# Altium project FLEXI_HAL_Quark.PrjPCB (part 3 of 5)

## Sheet USB_ULPI_Interface.SchDoc: STM32F446 CNC
size B; Author: AM; CompanyName: Expatria Technologies; DrawnBy: A.Marles; Engineer: AM; Organization: Expatria Technolgoies; Address1: PO Box 2084; Address3: Merritt, BC V1K 1B8; Address4: Canada; DocumentNumber: 7; Revision: A1; SheetNumber: 7; SheetTotal: 26
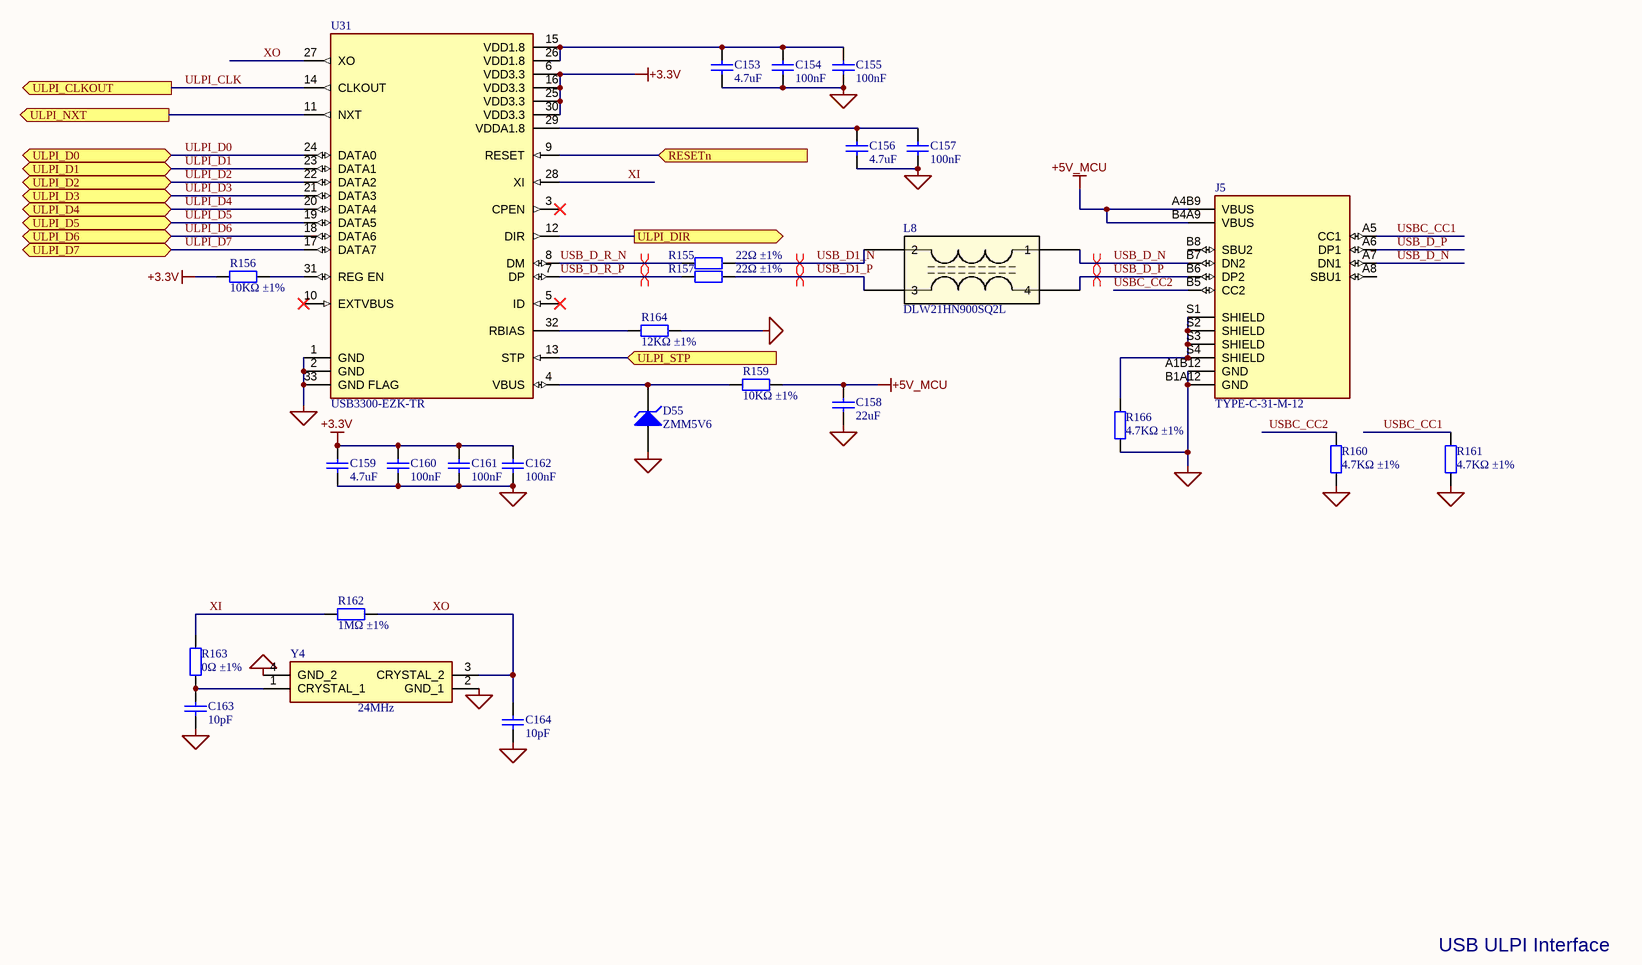
[diagram p10: USB_ULPI_Interface.SchDoc]

### Parts
C153  4.7uF  [0603_C]
C154  100nF  [0603_C]
C155  100nF  [0603_C]
C156  4.7uF  [0603_C]
C157  100nF  [0603_C]
C158  22uF  [0805_C]
C159  4.7uF  [0603_C]
C160  100nF  [0603_C]
C161  100nF  [0603_C]
C162  100nF  [0603_C]
C163  10pF  [0402_C]
C164  10pF  [0402_C]
D55  ZMM5V6  [LL-34]
J5  TYPE-C-31-M-12  [HRO_TYPE-C-31-M-12]
L8  DLW21HN900SQ2L  [DLW21HN121HQ2B]
R155  22Ω ±1%  [0603_R]
R156  10KΩ ±1%  [0603_R]
R157  22Ω ±1%  [0603_R]
R159  10KΩ ±1%  [0603_R]
R160  4.7KΩ ±1%  [0603_R]
R161  4.7KΩ ±1%  [0603_R]
R162  1MΩ ±1%  [0402_R]
R163  0Ω ±1%  [0402_R]
R164  12KΩ ±1%  [0603_R]
R166  4.7KΩ ±1%  [0603_R]
U31  USB3300-EZK-TR  [FP-32QFN-3304-5X5B-MFG]
Y4  value 24MHz  [YSX321SL]  (hidden comment: X322524MSB4SI)

### Ports
RESETn (in), ULPI_CLKOUT (out), ULPI_D0 (bidir), ULPI_D1 (bidir), ULPI_D2 (bidir), ULPI_D3 (bidir), ULPI_D4 (bidir), ULPI_D5 (bidir), ULPI_D6 (bidir), ULPI_D7 (bidir), ULPI_DIR (out), ULPI_NXT (out), ULPI_STP (in)

### Nets
+3.3V: C159.2 C160.2 C161.2 C162.2 R156.1 U31.6(VDD3.3) U31.16(VDD3.3) U31.25(VDD3.3) U31.30(VDD3.3)
+5V_MCU: C158.2 J5.A4B9(VBUS) J5.B4A9(VBUS) R159.2
MCU_GND: C153.1 C154.1 C155.1 C156.1 C157.1 C158.1 C159.1 C160.1 C161.1 C162.1 C163.1 C164.1 D55.1(A) J5.A1B12(GND) J5.B1A12(GND) R160.2 R161.2 R164.2 R166.2 U31.1(GND) U31.2(GND) U31.33(GND_FLAG) Y4.2(GND_1) Y4.4(GND_2)
STM_RESET: U31.9(RESET) ; port RESETn
ULPI_CLK: U31.14(CLKOUT) ; port ULPI_CLKOUT  [project net ULPI_CLKOUT]
ULPI_D0: U31.24(DATA0) ; port ULPI_D0
ULPI_D1: U31.23(DATA1) ; port ULPI_D1
ULPI_D2: U31.22(DATA2) ; port ULPI_D2
ULPI_D3: U31.21(DATA3) ; port ULPI_D3
ULPI_D4: U31.20(DATA4) ; port ULPI_D4
ULPI_D5: U31.19(DATA5) ; port ULPI_D5
ULPI_D6: U31.18(DATA6) ; port ULPI_D6
ULPI_D7: U31.17(DATA7) ; port ULPI_D7
ULPI_DIR: U31.12(DIR) ; port ULPI_DIR
ULPI_NXT: U31.11(NXT) ; port ULPI_NXT
ULPI_STP: U31.13(STP) ; port ULPI_STP
USB_D1_N: L8.2 R155.2
USB_D1_P: L8.3 R157.2
USB_D_N: J5.A7(DN1) J5.B7(DN2) L8.1
USB_D_P: J5.A6(DP1) J5.B6(DP2) L8.4
USB_D_R_N: R155.1 U31.8(DM)
USB_D_R_P: R157.1 U31.7(DP)
USBC_CC1: J5.A5(CC1) R161.1
USBC_CC2: J5.B5(CC2) R160.1
XI: R162.1 R163.1 U31.28(XI)
XO: C164.2 R162.2 U31.27(XO) Y4.3(CRYSTAL_2)
NetC153_2: C153.2 C154.2 C155.2 U31.15(VDD1.8) U31.26(VDD1.8)
NetC156_2: C156.2 C157.2 U31.29(VDDA1.8)
NetC163_2: C163.2 R163.2 Y4.1(CRYSTAL_1)
NetD55_2: D55.2(K) R159.1 U31.4(VBUS)
NetJ5_S1: J5.S1(SHIELD) J5.S2(SHIELD) J5.S3(SHIELD) J5.S4(SHIELD) R166.1
NetR156_2: R156.2 U31.31(REG_EN)
NetR164_1: R164.1 U31.32(RBIAS)

Not connected (* = marked no-connect by the designer): J5 A8(SBU1) B8(SBU2); U31 3(CPEN)* 5(ID)* 10(EXTVBUS)*

### Layout directives
differential pair: USB_D1_N, USB_D1_P, USB_D_N, USB_D_P, USB_D_R_N, USB_D_R_P

### Notes on the sheet
- USB ULPI Interface
- SHEET
- Expatria Technologies
- PO Box 2084
- Merritt, BC V1K 1B8
- PHONE: (778) 238-9336
- PROJECT
- SIZE
- ENGR
- MODIFIED
- DOCUMENT
- REV
- Copyright Expatria Technologies 2022. This document describes Open Hardware and is licensed under the CERN-OHL-S v2. No warranty is implied or expressed.
- EMAIL: info@expatria.ca
- B
- /

### Library data of the parts
C153 C156 C159 = 0603 4.7uF (475) 10% 16V: Chip capacitors; Manufacturer: Samsung Electro-Mechanics; PartNumber: CL10A475KO8NNNC; Tolerance: 10%; Voltage: 16V; ComponentLink1Description: Supplier link; ComponentLink1URL: http://www.szlcsc.com/product/details_20375.html; Package: 0603; Supplier: LC; SuppliersPartNumber: C19666; Capacitance: 4.7uF
C154 C155 C157 C160-C162 = 0603 100nF (104) 10% 50V: Chip capacitors; Manufacturer: YAGEO; PartNumber: CC0603KRX7R9BB104; Tolerance: 10%; Voltage: 50V; ComponentLink1Description: Supplier link; ComponentLink1URL: http://www.szlcsc.com/product/details_15331.html; Package: 0603; Supplier: LC; SuppliersPartNumber: C14663; Capacitance: 100nF
C158 = 0805 22uF (226) 20% 25V: Chip capacitors; Manufacturer: Samsung Electro-Mechanics; PartNumber: CL21A226MAQNNNE; Tolerance: 20%; Voltage: 25V; Package: 0805; Supplier: LC; SuppliersPartNumber: C2922481; Capacitance: 22uF; ComponentLink1Description: Supplier link; ComponentLink1URL: http://www.szlcsc.com/product/details_46786.html
C163 C164 = 0402 10pF (100) 5% 50V: Chip capacitors; Manufacturer: Samsung Electro-Mechanics; Manufacturer Part Number: CL05C100JB5NNNC; Tolerance: 5%; Voltage: 50V; ComponentLink1Description: Supplier link; ComponentLink1URL: http://www.szlcsc.com/product/details_33914.html; Package: 0402; Supplier: LC; SuppliersPartNumber: C32949; Capacitance: 10pF
D55 = LL-34 ZMM5V6: 500mW - 0.1uA @ 1V 5.6V LL-34 Zener Diodes ROHS; ComponentLink1Description: 供应商链接; ComponentLink1URL: http://www.szlcsc.com/product/details_8541.html; Package: LL-34; Supplier: LC; SuppliersPartNumber: C8062
J5 = TYPE-C-31-M-12: USB Connectors 24 Receptacle 1 8.94*7.3mm RoHS; MF: HRO Electronics Co., Ltd.; Value: *; SnapEDA_Link: https://www.snapeda.com/parts/TYPE-C-31-M-12/HRO%20Electronics%20Co.,%20Ltd./view-part/3228496/?ref=snap; Package: Package; MP: TYPE-C-31-M-12; Price: None; Availability: Unavailable; SuppliersPartNumber: C2765186
L8 = DLW21HN900SQ2L: 90Ω@100MHz -40℃~+85℃ 350mΩ 50V 2 330mA 125V SMD-4P Common Mode Filters ROHS; Manufacturer: Murata Electronics; SuppliersPartNumber: C80529; Manufacturer Part Number: DLW21HN900SQ2L; Supplier: LCSC; Value: DLW21HN900SQ2L
R155 R157 = 0603 22R (22R0) 1%: Chip resistor; Manufacturer: Uniroyal Elec; PartNumber: 0603WAF220JT5E; Power: 1/10W; ComponentLink1Description: Supplier link; ComponentLink1URL: http://www.szlcsc.com/product/details_24078.html; Package: 0603; Supplier: LC; SuppliersPartNumber: C23345; Resistance: 22Ω; Tolerance: 1%
R156 R159 = 0603 10K (1002) 1%: Chip resistor; Manufacturer: Uniroyal Elec; PartNumber: 0603WAF1002T5E; Power: 1/10W; ComponentLink1Description: Supplier link; ComponentLink1URL: http://www.szlcsc.com/product/details_26547.html; Package: 0603; Supplier: LC; SuppliersPartNumber: C25804; Resistance: 10KΩ; Tolerance: 1%
R160 R161 R166 = 0603 4.7K (4701) 1%: Chip resistor; Manufacturer: Uniroyal Elec; PartNumber: 0603WAF4701T5E; Power: 1/10W; ComponentLink1Description: Supplier link; ComponentLink1URL: http://www.szlcsc.com/product/details_23889.html; Package: 0603; Supplier: LC; SuppliersPartNumber: C23162; Resistance: 4.7KΩ; Tolerance: 1%
R162 = 0402 1M (1004) 1%: Chip resistor; Manufacturer: Uniroyal Elec; Manufacturer Part Number: 0402WGF1004TCE; Power: 1/16W; ComponentLink1Description: Supplier link; ComponentLink1URL: http://www.szlcsc.com/product/details_26826.html; Package: 0402; Supplier: LC; SuppliersPartNumber: C26083; Resistance: 1MΩ; Tolerance: 1%
R163 = 0402 0R (0R0) 1%: Chip resistor; Manufacturer: Uniroyal Elec; Manufacturer Part Number: 0402WGF0000TCE; Power: 1/16W; ComponentLink1Description: Supplier link; ComponentLink1URL: http://www.szlcsc.com/product/details_17853.html; Package: 0402; Supplier: LC; SuppliersPartNumber: C17168; Resistance: 0Ω; Tolerance: 1%
R164 = 0603 12K (1202) 1%: Chip resistor; Manufacturer: Uniroyal Elec; PartNumber: 0603WAF1202T5E; Power: 1/10W; ComponentLink1Description: Supplier link; ComponentLink1URL: http://www.szlcsc.com/product/details_23517.html; Package: 0603; Supplier: LC; SuppliersPartNumber: C22790; Resistance: 12KΩ; Tolerance: 1%
U31 = CMP-0186-00339-2: IC CONTROLLER USB 32QFN; Manufacturer: Microchip; Min Supply Voltage: 3V; Standoff Height: 0mm; Interface: USB,Other; Number Of Ports: 1; Usb Standard: USB 2.0; Nominal Supply Current: 25.5-39600uA; Max Supply Voltage: 3.6V; Temperature Range High: +85°C; Mouser Description: USB Interface IC USB 2.0 PHY ULPI; Device Class L3: USB Interface ICs; Package: 32QFN-3304-5X5B; ComponentLink2URL: http://ww1.microchip.com/downloads/en/DeviceDoc/00001783C.pdf; Ambient Temperature Range Low: -40°C; Temperature Range Low: -40°C; Temperature: -40°C to +85°C; ComponentLink2Description: Datasheet; RoHS: TRUE; Digikey Description: IC CONTROLLER USB 32QFN; Device Class L1: Integrated Circuits (ICs); Manufacturer Part Number: USB3300-EZK-TR; Automotive: No; Height: 1mm; Ipc Land Pattern Name: QFN50P500X500X85-32; Lead Free: Yes; Ambient Temperature Range High: +85°C; Category: IC; Device Class L2: Interface ICs; Octopart: https://octopart.com/usb3300-ezk-tr-microchip-24995444
Y4 = X322525MSB4SI: 24MHz SMD Crystal Resonator 20pF ±10ppm ±30ppm -40℃~+85℃ SMD3225-4P Crystals ROHS; Manufacturer 1: Yangxing Tech; Height: 0.8mm; SuppliersPartNumber: C15643; Supplier 1: LCSC; Supplier Part Number 1: C15643; Manufacturer Part Number 1: X322524MSB4SI; Manufacturer: Yangxing Tech; Manufacturer Part Number: X322524MSB4SI

## Sheet 5V_Power_Supply.SchDoc: STM32F446 CNC
size B; Author: AM; CompanyName: Expatria Technologies; DrawnBy: A.Marles; Engineer: AM; Organization: Expatria Technolgoies; DocumentNumber: 9; Revision: A1; SheetNumber: 9; SheetTotal: 14
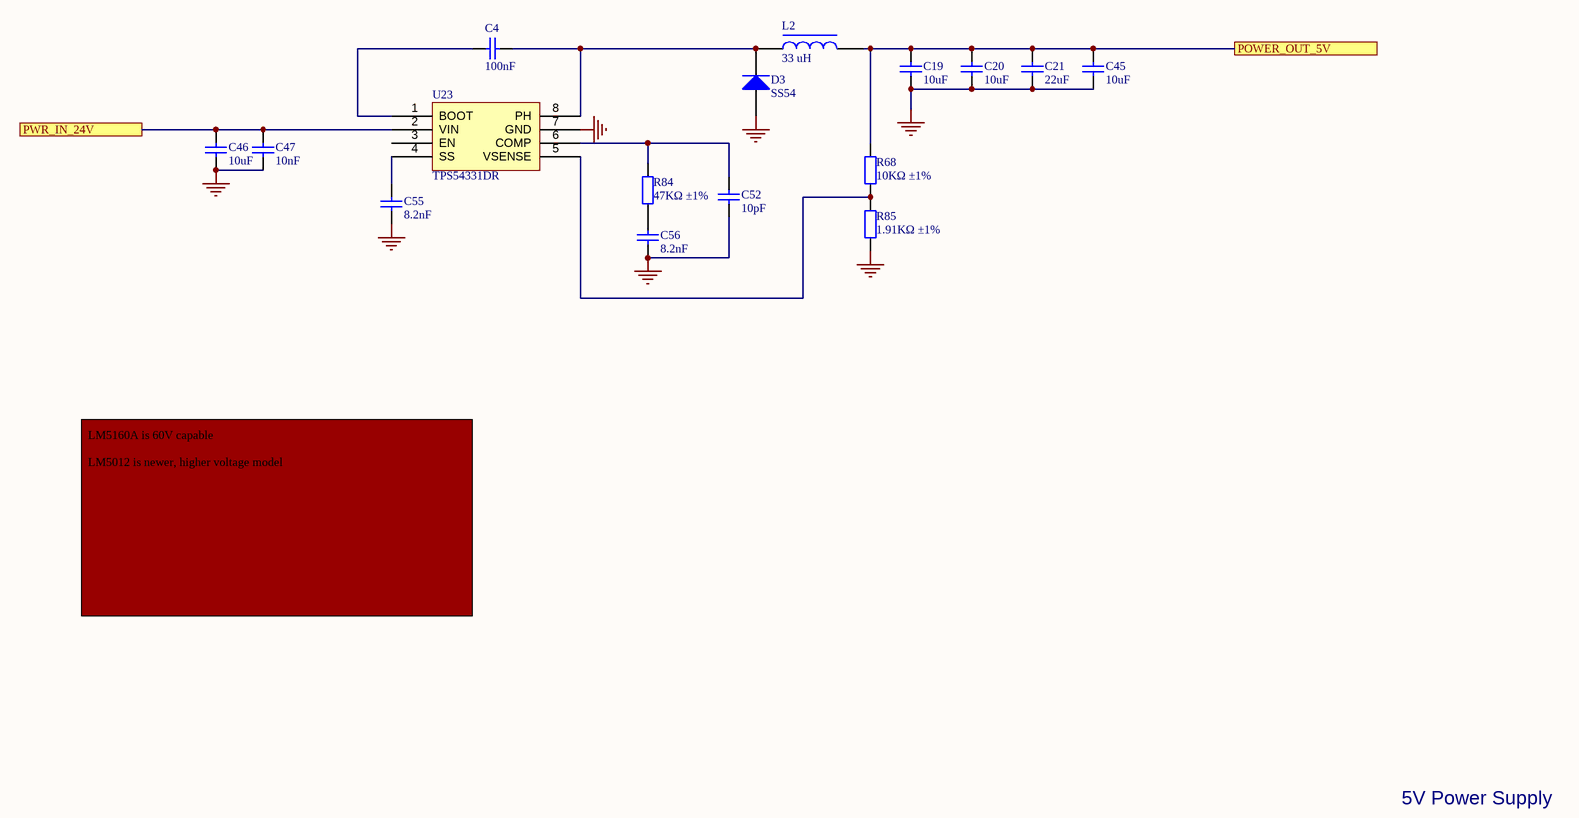
[diagram p11: 5V_Power_Supply.SchDoc]

### Parts
C4  100nF  [0603_C]
C19  10uF  [1206_C]
C20  10uF  [1206_C]
C21  22uF  [0805_C]
C45  10uF  [1206_C]
C46  10uF  [1206_C]
C47  10nF  [0603_C]
C52  10pF  [0603_C]
C55  8.2nF  [0603_C]
C56  8.2nF  [0603_C]
D3  SS54  [SMA(DO-214AC)_S1]
L2  33 uH  [INDPM7366X300N]
R68  10KΩ ±1%  [0603_R]
R84  47KΩ ±1%  [0603_R]
R85  1.91KΩ ±1%  [0603_R]
U23  TPS54331DR  [SOIC-8_150mil]

### Ports
POWER_OUT_5V, PWR_IN_24V

### Nets
+5V: C19.2 C20.2 C21.2 C45.2 L2.2 R68.2 ; port POWER_OUT_5V
+12V: C46.2 C47.2 U23.2(VIN) ; port PWR_IN_24V
GND: C19.1 C20.1 C21.1 C45.1 C46.1 C47.1 C52.1 C55.1 C56.1 D3.1(A) R85.1 U23.7(GND)
NetC4_1: C4.1 U23.1(BOOT)
NetC4_2: C4.2 D3.2(K) L2.1 U23.8(PH)
NetC52_2: C52.2 R84.2 U23.6(COMP)
NetC55_2: C55.2 U23.4(SS)
NetC56_2: C56.2 R84.1
NetR68_1: R68.1 R85.2 U23.5(VSENSE)

Not connected (* = marked no-connect by the designer): U23 3(EN)

### Notes on the sheet
- LM5160A is 60V capable
  LM5012 is newer, higher voltage model
- 5V Power Supply
- SHEET
- Expatria Technologies
- 1136 Glade Court
- Port Coquitlam, BC V3B 1R5
- PROJECT
- SIZE
- ENGR
- MODIFIED
- DOCUMENT
- REV
- Copyright Expatria Technologies 2022. This document describes Open Hardware and is licensed under the CERN-OHL-S v2. No warranty is implied or expressed.
- EMAIL: INFO@EXPATRIA.CA
- B
- /

### Library data of the parts
C4 = 0603 100nF (104) 10% 50V: as C154 on sheet USB_ULPI_Interface; Package: 0603; Supplier: LC; SuppliersPartNumber: C14663; Capacitance: 100nF; Manufacturer 1: YAGEO
C19 C20 C45 C46 = 1206 10uF (106) 10% 50V: Chip capacitors; Manufacturer: Samsung Electro-Mechanics; PartNumber: CL31A106KBHNNNE; Tolerance: 10%; Voltage: 50V; Package: 1206; Supplier: LC; SuppliersPartNumber: C13585; Capacitance: 10uF
  C19 C20 C45: ComponentLink1Description: Supplier link; ComponentLink1URL: http://www.szlcsc.com/product/details_14236.html
  C46: Manufacturer 1: Samsung Electro-Mechanics
C21 = 0805 22uF (226) 20% 25V: as C158 on sheet USB_ULPI_Interface; Package: 0805; Supplier: LC; SuppliersPartNumber: C2922481; Capacitance: 22uF; ComponentLink1Description: Supplier link; ComponentLink1URL: http://www.szlcsc.com/product/details_46786.html
C47 = 0603 10nF (103) 10% 50V: Chip capacitors; Manufacturer: Guangdong Fenghua Advanced Tech; PartNumber: 0603B103K500NT; Tolerance: 10%; Voltage: 50V; Package: 0603; Supplier: LC; SuppliersPartNumber: C57112; Capacitance: 10nF; ComponentLink1Description: Supplier link; ComponentLink1URL: http://www.szlcsc.com/product/details_58143.html
C52 = 0603 10pF (100) 5% 50V: Chip capacitors; Manufacturer: Samsung Electro-Mechanics; PartNumber: CL10C100JB8NNNC; Tolerance: 5%; Voltage: 50V; Package: 0603; Supplier: LC; SuppliersPartNumber: C1634; Capacitance: 10pF; ComponentLink1Description: Supplier link; ComponentLink1URL: http://www.szlcsc.com/product/details_1986.html
C55 C56 = 0603 8.2nF (822) 10% 50V: Chip capacitors; Manufacturer: Samsung Electro-Mechanics; PartNumber: CL10B822KB8NNNC; Tolerance: 10%; Voltage: 50V; Package: 0603; Supplier: LC; SuppliersPartNumber: C27920; Capacitance: 8.2nF
  C55: Manufacturer 1: Samsung Electro-Mechanics
  C56: ComponentLink1Description: Supplier link; ComponentLink1URL: http://www.szlcsc.com/product/details_28670.html
D3 = SMA(DO-214AC) SS54: 40V 5A 550mV@5A; Manufacturer 1: MDD; Package: SMA(DO-214AC); Supplier: LC; SuppliersPartNumber: C22452; Manufacturer Part Number 1: SS54
L2 = 1206 10uH 10%: 33uH ±20% 2A 270mΩ SMD,6.6x7.3x3.0mm Power Inductors RoHS; Package: SMD_6.6x7.3x3.0mm; Supplier: JLCPCB; SuppliersPartNumber: C329385
R68 = 0603 10K (1002) 1%: as R156 on sheet USB_ULPI_Interface; Package: 0603; Supplier: LC; SuppliersPartNumber: C25804; Resistance: 10KΩ; Tolerance: 1%; ComponentLink1Description: Supplier link; ComponentLink1URL: http://www.szlcsc.com/product/details_26547.html
R84 = 0603 47K (4702) 1%: Chip resistor; Manufacturer: Uniroyal Elec; PartNumber: 0603WAF4702T5E; Power: 1/10W; Package: 0603; Supplier: LC; SuppliersPartNumber: C25819; Resistance: 47KΩ; Tolerance: 1%; ComponentLink1Description: Supplier link; ComponentLink1URL: http://www.szlcsc.com/product/details_26562.html
R85 = 0603 2K (2001) 1%: Chip resistor; Manufacturer: Uniroyal Elec; PartNumber: 0603WAF1911T5E; Power: 1/10W; Package: 0603; Supplier: LC; SuppliersPartNumber: C22853; Resistance: 1.91KΩ; Tolerance: 1%; ComponentLink1Description: Supplier link; ComponentLink1URL: http://www.szlcsc.com/product/details_23702.html
U23 = TPS54331DR_[C9865]: Switching Voltage Regulators 3A 28V In Step Down SWIFT DC/DC Cnvrtr; Package: SOIC-8_150mil; Supplier: LC; SuppliersPartNumber: C9865

## Sheet 12V_Power_Supply.SchDoc: FlexiHAL-STP
size B
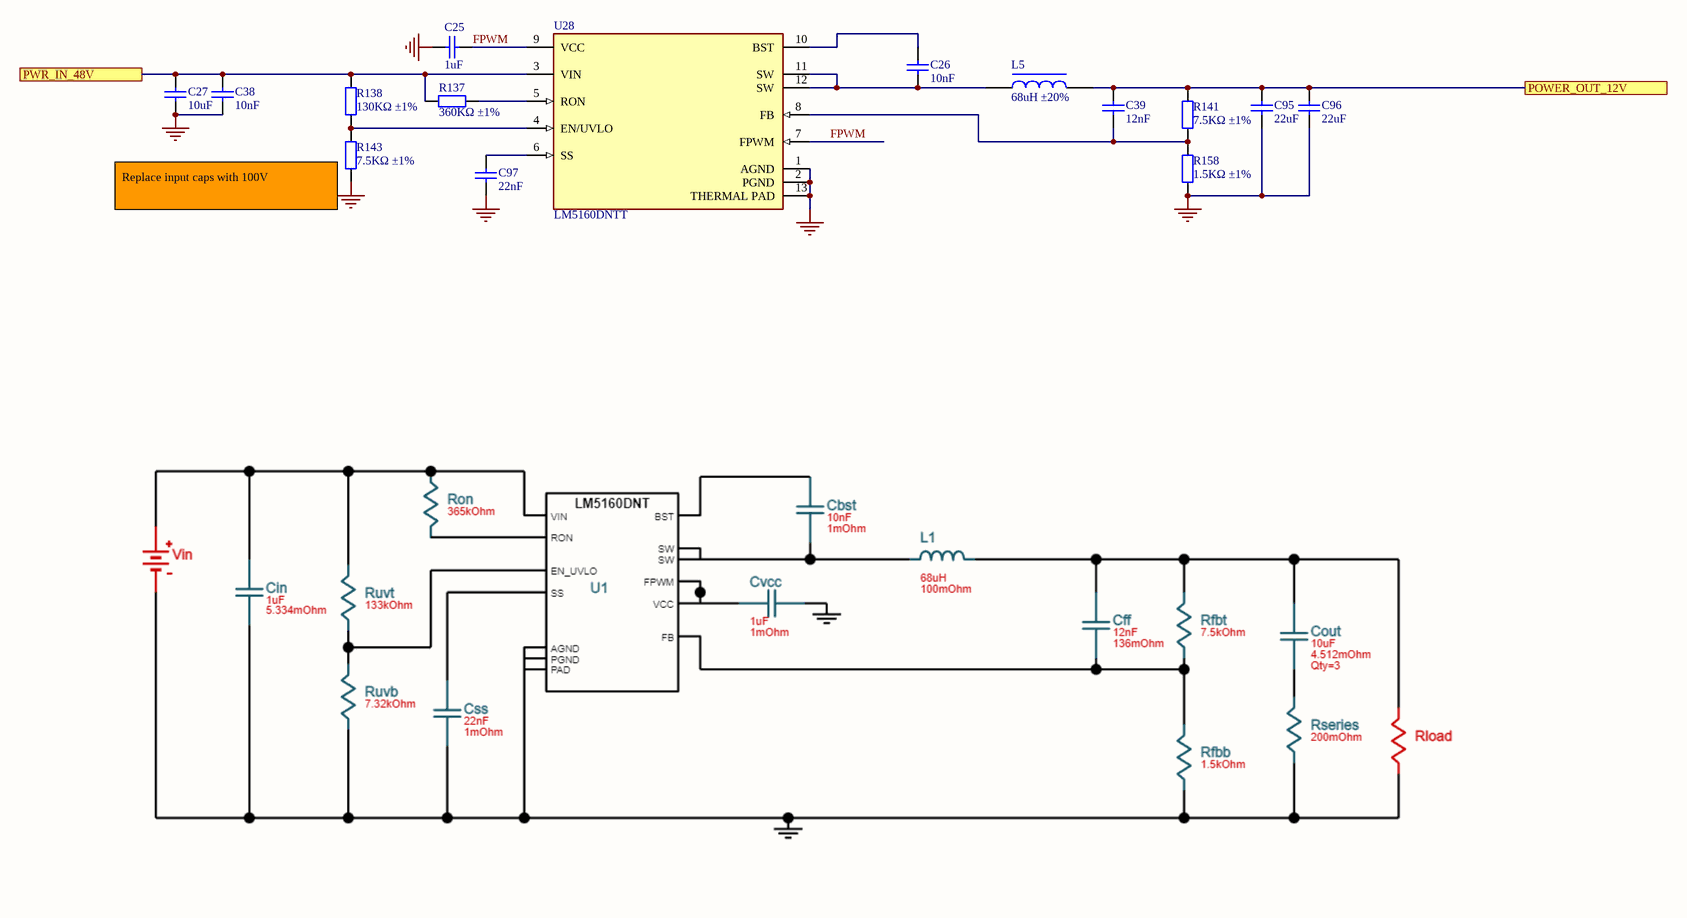
[diagram p12: 12V_Power_Supply.SchDoc]

### Parts
C25  1uF  [0603_C]
C26  10nF  [0603_C]
C27  10uF  [1206_C]
C38  10nF  [0603_C]
C39  12nF  [0603_C]
C95  22uF  [0805_C]
C96  22uF  [0805_C]
C97  22nF  [0603_C]
L5  68uH ±20%  [INDP126126X68N]
R137  360KΩ ±1%  [0603_R]
R138  130KΩ ±1%  [0603_R]
R141  7.5KΩ ±1%  [0603_R]
R143  7.5KΩ ±1%  [0603_R]
R158  1.5KΩ ±1%  [0603_R]
U28  LM5160DNTT  [FP-DNT0012B-MFG]

### Ports
POWER_OUT_12V, PWR_IN_48V

### Nets
GND: C25.1 C27.1 C38.1 C95.1 C96.1 C97.1 R143.1 R158.1 U28.1(AGND) U28.2(PGND) U28.13(THERMAL_PAD)
MOTOR_VCC_48V: C27.2 C38.2 R137.1 R138.2 U28.3(VIN) ; port PWR_IN_48V
FPWM: C25.2 U28.7(FPWM) U28.9(VCC)
POWER_OUT_12V: C39.2 C95.2 C96.2 L5.2 R141.2 ; port POWER_OUT_12V
NetC26_1: C26.1 U28.10(BST)
NetC26_2: C26.2 L5.1 U28.11(SW) U28.12(SW)
NetC39_1: C39.1 R141.1 R158.2 U28.8(FB)
NetC97_2: C97.2 U28.6(SS)
NetR137_2: R137.2 U28.5(RON)
NetR138_1: R138.1 R143.2 U28.4(EN/UVLO)

### Notes on the sheet
- (near R143) Replace input caps with 100V
- SHEET
- Expatria Technologies
- 1136 Glade Court
- Port Coquitlam, BC V3B 1R5
- PHONE: (778) 238-9336
- PROJECT
- SIZE
- ENGR
- MODIFIED
- DOCUMENT
- REV
- This document contains confidential and proprietary information. No disclosure, reproduction, or transfer of this material in part or in its entirety shall be done without prior written approval.
- EMAIL: INFO@EXPATRIA.CA
- B
- /

### Library data of the parts
C25 = 0603 1uF (105) 10% 50V: Chip capacitors; Manufacturer: Samsung Electro-Mechanics; PartNumber: CL10A105KB8NNNC; Tolerance: 10%; Voltage: 50V; ComponentLink1Description: Supplier link; ComponentLink1URL: http://www.szlcsc.com/product/details_16531.html; Package: 0603; Supplier: LC; SuppliersPartNumber: C15849; Capacitance: 1uF
C26 C38 = 0603 10nF (103) 10% 50V: as C47 on sheet 5V_Power_Supply; ComponentLink1Description: Supplier link; ComponentLink1URL: http://www.szlcsc.com/product/details_58143.html; Package: 0603; Supplier: LC; SuppliersPartNumber: C57112; Capacitance: 10nF
C27 = 1206 10uF (106) 10% 50V: as C19 on sheet 5V_Power_Supply; ComponentLink1Description: Supplier link; ComponentLink1URL: http://www.szlcsc.com/product/details_14236.html; Package: 1206; Supplier: LC; SuppliersPartNumber: C13585; Capacitance: 10uF
C39 = 0603 12nF (123) 10% 50V: Chip capacitors; Manufacturer: Guangdong Fenghua Advanced Tech; PartNumber: 0603B123K500NT; Tolerance: 10%; Voltage: 50V; ComponentLink1Description: Supplier link; ComponentLink1URL: http://www.szlcsc.com/product/details_1945.html; Package: 0603; Supplier: LC; SuppliersPartNumber: C1593; Capacitance: 12nF
C95 C96 = 0805 22uF (226) 20% 25V: as C158 on sheet USB_ULPI_Interface; ComponentLink1Description: Supplier link; ComponentLink1URL: http://www.szlcsc.com/product/details_46786.html; Package: 0805; Supplier: LC; SuppliersPartNumber: C2922481; Capacitance: 22uF
C97 = 0603 22nF (223) 10% 50V: Chip capacitors; Manufacturer: Samsung Electro-Mechanics; PartNumber: CL10B223KB8NNNC; Tolerance: 10%; Voltage: 50V; ComponentLink1Description: Supplier link; ComponentLink1URL: http://www.szlcsc.com/product/details_21834.html; Package: 0603; Supplier: LC; SuppliersPartNumber: C21122; Capacitance: 22nF
L5 = 12.5x12.5x6.5 68uH 20%: 2A 68uH ±20% SMD,12.5x12.5mm Power Inductors ROHS; Package: SMD,12.5x12.5mm; Supplier: LC; SuppliersPartNumber: C693891
R137 = 0603 360K (3603) 1%: Chip resistor; Manufacturer: Uniroyal Elec; PartNumber: 0603WAF3603T5E; Power: 1/10W; ComponentLink1Description: Supplier link; ComponentLink1URL: http://www.szlcsc.com/product/details_23873.html; Package: 0603; Supplier: LC; SuppliersPartNumber: C23146; Resistance: 360KΩ; Tolerance: 1%
R138 = 0603 130K (1303) 1%: Chip resistor; Manufacturer: Uniroyal Elec; PartNumber: 0603WAF1303T5E; Power: 1/10W; ComponentLink1Description: Supplier link; ComponentLink1URL: http://www.szlcsc.com/product/details_23522.html; Package: 0603; Supplier: LC; SuppliersPartNumber: C22795; Resistance: 130KΩ; Tolerance: 1%
R141 R143 = 0603 7.5K (7501) 1%: Chip resistor; Manufacturer: Uniroyal Elec; PartNumber: 0603WAF7501T5E; Power: 1/10W; ComponentLink1Description: Supplier link; ComponentLink1URL: http://www.szlcsc.com/product/details_23961.html; Package: 0603; Supplier: LC; SuppliersPartNumber: C23234; Resistance: 7.5KΩ; Tolerance: 1%
R158 = 0603 1.5K (1501) 1%: Chip resistor; Manufacturer: Uniroyal Elec; PartNumber: 0603WAF1501T5E; Power: 1/10W; ComponentLink1Description: Supplier link; ComponentLink1URL: http://www.szlcsc.com/product/details_23570.html; Package: 0603; Supplier: LC; SuppliersPartNumber: C22843; Resistance: 1.5KΩ; Tolerance: 1%
U28 = CMP-04918-000448-1: IC REG BCK FLYBCK ADJ 12WSON; Min Input Voltage: 4.5V; Operating Supply Current: 2.3mA; Output Current: 1.5A; Number of Outputs: 1; Topology: Flyback; Synchronous Rectifier: Yes; Output Type: Adjustable; Max Input Voltage: 65V; Min Output Voltage: 2V; Switching Frequency: 1MHz; Output Voltage: 60V; Mount: Surface Mount; Min Operating Temperature: -40°C; Package Quantity: 250; Min Supply Voltage: 4.5V; Max Operating Temperature: 125°C; RoHS Compliant: Yes; Contact Plating: Tin; Height: 0.8mm; Packaging: Tape and Reel; Quiescent Current: 2.3mA; Lead Free: Lead Free; Number of Pins: 12; Max Output Current: 1.5A; REACH SVHC: No SVHC; Width: 4mm; Operating Supply Voltage: 65V; Max Output Voltage: 60V; Length: 4mm; SuppliersPartNumber: C473375

## Sheet CANBUS_Pendant.SchDoc: RP2040 CNC
size B; Author: AM; CompanyName: Expatria Technologies; DrawnBy: A.Marles; Engineer: AM; Organization: Expatria Technolgoies; Address1: PO Box 2084; Address3: Merritt, BC V1K 1B8; Address4: Canada; DocumentNumber: 26; Revision: A1; SheetNumber: 23; SheetTotal: 26
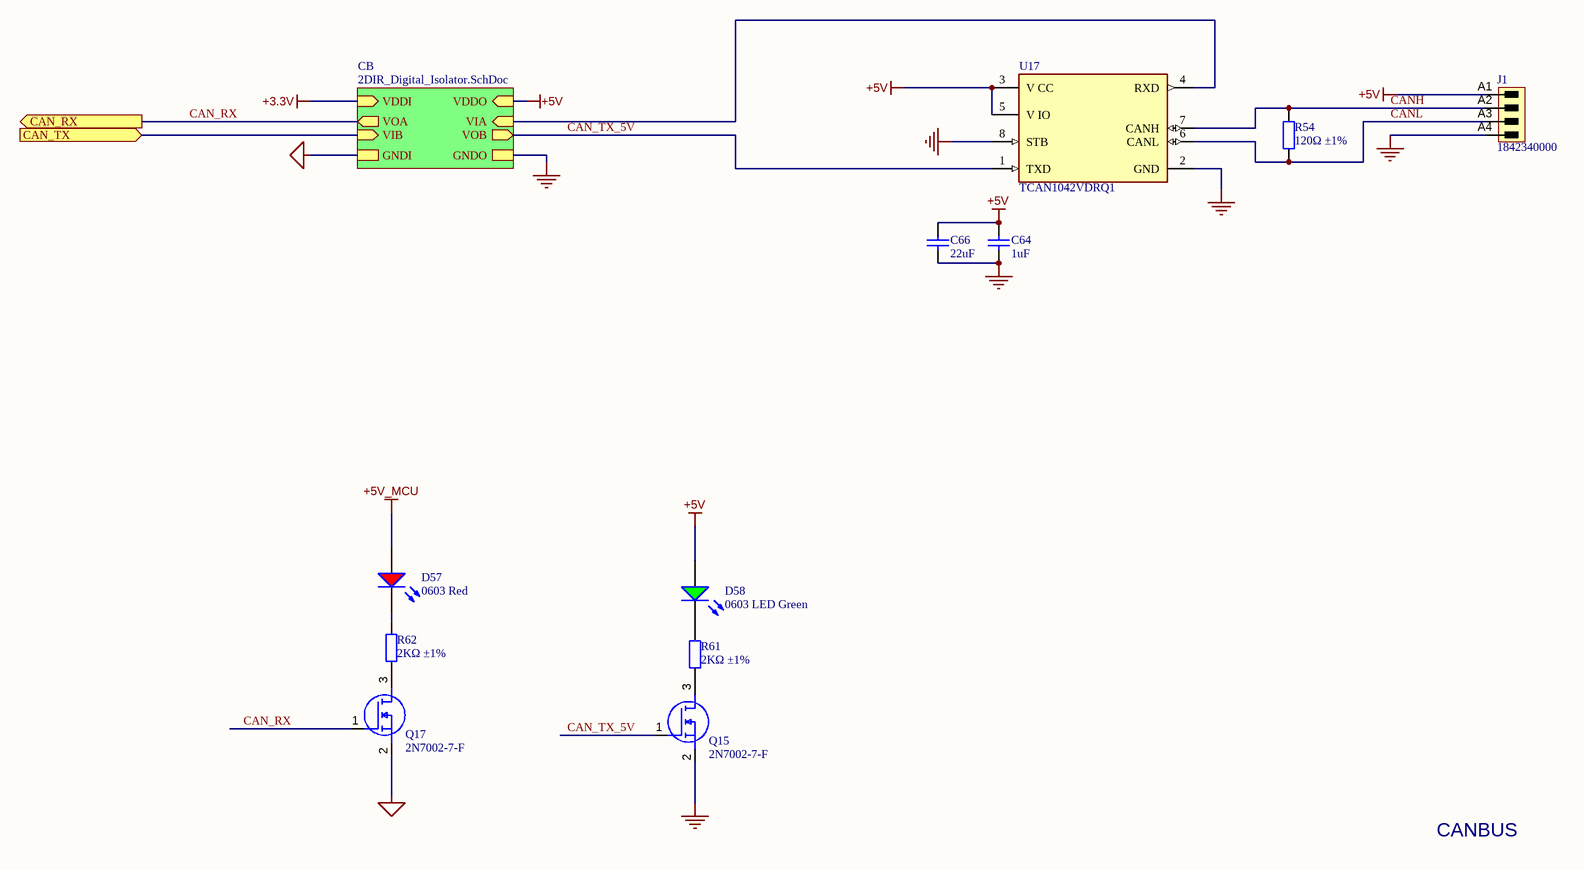
[diagram p13: CANBUS_Pendant.SchDoc]

### Parts
C64  1uF  [0603_C]
C66  22uF  [0603_C]
D57  0603 Red  [0603_LED_S1]
D58  0603 LED Green  [0603_LED_S1]
J1  1842340000  [691321100004]
Q15  2N7002-7-F  [SOT-23(SOT-23-3)]
Q17  2N7002-7-F  [SOT-23(SOT-23-3)]
R54  120Ω ±1%  [0805_R]
R61  2KΩ ±1%  [0402_R]
R62  2KΩ ±1%  [0402_R]
U17  TCAN1042VDRQ1  [FP-D0008B-IPC_C]

### Sub-sheets
CB = 2DIR_Digital_Isolator.SchDoc: VDDO (in), VIB (in), VIA (in), VOB (out), VOA (out), VDDI (in), GNDO, GNDI

### Ports
CAN_RX (out), CAN_TX (in)

### Nets
+5V: C64.2 C66.2 D58.A J1.A1 U17.3(V_CC) U17.5(V_IO) ; sheet CB/VDDO
+5V_MCU: D57.A
GND: C64.1 C66.1 J1.A4 Q15.2(S) U17.2(GND) U17.8(STB) ; sheet CB/GNDO
MCU_GND: Q17.2(S) ; sheet CB/GNDI
CAN_RX: Q17.1(G) ; port CAN_RX, sheet CB/VOA
CAN_TX: port CAN_TX, sheet CB/VIB
CAN_TX_5V: Q15.1(G) U17.1(TXD) ; sheet CB/VOB
CANH: J1.A2 R54.2 U17.7(CANH)
CANL: J1.A3 R54.1 U17.6(CANL)
VIA: U17.4(RXD) ; sheet CB/VIA
NetD57_K: D57.K R62.2
NetD58_K: D58.K R61.2
NetQ15_3: Q15.3(D) R61.1
NetQ17_3: Q17.3(D) R62.1

### Notes on the sheet
- CANBUS
- SHEET
- Expatria Technologies
- PO Box 2084
- Merritt, BC V1K 1B8
- PHONE: (778) 238-9336
- PROJECT
- SIZE
- ENGR
- MODIFIED
- DOCUMENT
- REV
- Copyright Expatria Technologies 2022. This document describes Open Hardware and is licensed under the CERN-OHL-S v2. No warranty is implied or expressed.
- EMAIL: info@expatria.ca
- B
- /

### Library data of the parts
C64 = 0603 1uF (105) 10% 50V: Chip capacitors; Manufacturer: Samsung Electro-Mechanics; Manufacturer Part Number: CL10A105KB8NNNC; Tolerance: 10%; Voltage: 50V; ComponentLink1Description: Supplier link; ComponentLink1URL: http://www.szlcsc.com/product/details_16531.html; Package: 0603; Supplier: LCSC; SuppliersPartNumber: C15849; Capacitance: 1uF
C66 = 0603 22uF (226) 20% 6.3V: Chip capacitors; Manufacturer: Samsung Electro-Mechanics; PartNumber: CL10A226MQ8NRNC; Tolerance: 20%; Voltage: 6.3V; ComponentLink1Description: Supplier link; ComponentLink1URL: http://www.szlcsc.com/product/details_60514.html; Package: 0603; Supplier: LC; SuppliersPartNumber: C59461; Capacitance: 22uF
D57 = 19-213SURC/S530-A3/TR8: 20mA 632nm Colorless transparence 624nm~624nm -40℃~+85℃ Red 120° 60mW 0603 Light Emitting Diodes (LED) ROHS; Manufacturer: Everlight Elec; ComponentLink1Description: 供应商链接; ComponentLink1URL: http://www.szlcsc.com/product/details_2659.html; Package: 0603; Supplier: LC; SuppliersPartNumber: C72039; Color: Red; Supplier 1: LC; Supplier Part Number 1: C72039; Manufacturer Part Number: 19-213SURC/S530-A3/TR8
D58 = 19-217/GHC-YR1S2/3T: Colorless transparence -40℃~+85℃ 520nm~535nm Emerald 120° 110mW 0603 Light Emitting Diodes (LED) ROHS; Manufacturer: Everlight Elec; Package: 0603; Supplier: LC; SuppliersPartNumber: C72043; Color: Green; Manufacturer Part Number: 19-217/GHC-YR1S2/3T
J1 = 3.5mm Terminal Header 4p: OMNIMATE Signal - series BL/SL 3.50; Revision: V1; SuppliersPartNumber: C880556; ComponentLink1URL: http://www.weidmueller.com/; ComponentLink1Description: Manufacturer URL; Supplier: LCSC
Q15 Q17 = 2N7002-7-F: 60V 115mA 7.5Ω@5V,50mA 370mW N Channel SOT-23 MOSFETs ROHS; Manufacturer: Diodes Inc.; SuppliersPartNumber: C85049; Manufacturer Part Number: 2N7002-7-F; Value: 2N7002-7-F; Datasheet Link: https://datasheet.datasheetarchive.com/originals/distributors/SFDatasheet-0/sf-0003625.pdf; Height: 1.2mm; Manufacturer_Part_Number: 2N7002-7-F; Mouser Part Number: 621-2N7002-F; Mouser Price/Stock: https://www.mouser.co.uk/ProductDetail/Diodes-Incorporated/2N7002-7-F?qs=jMXWnm70%252BC%252BAX%252BMLzUkTZg%3D%3D; Arrow Part Number: 2N7002-7-F; Arrow Price/Stock: https://www.arrow.com/en/products/2n7002-7-f/diodes-incorporated?region=nac
R54 = 0805 120R (1200) 1%: Chip resistor; Manufacturer: Uniroyal Elec; Manufacturer Part Number: 0805W8F1200T5E; Power: 1/8W; ComponentLink1Description: Supplier link; ComponentLink1URL: http://www.szlcsc.com/product/details_18125.html; Package: 0805; Supplier: LCSC; SuppliersPartNumber: C17437; Tolerance: 1%
R61 R62 = 0402 2K (2001) 1%: Chip resistor; Manufacturer: Uniroyal Elec; Manufacturer Part Number: 0402WGF2001TCE; Power: 1/16W; ComponentLink1Description: Supplier link; ComponentLink1URL: http://www.szlcsc.com/product/details_4516.html; Package: 0402; Supplier: LC; SuppliersPartNumber: C4109; Resistance: 2KΩ; Tolerance: 1%
U17 = CMP-04872-000073-1: IC TRANSCEIVER 1/1 8SOIC; Data Rate: 5Mbps; Max Operating Temperature: 125°C; Mount: Surface Mount; Packaging: Tape and Reel; Case/Package: SOIC; RoHS Compliant: Yes; Lead Free: Lead Free; Number of Pins: 8; Min Operating Temperature: -55°C

## Sheet Encoder_Input.SchDoc: STM32F446 CNC
size B; Author: AM; CompanyName: Expatria Technologies; DrawnBy: A.Marles; Engineer: AM; Organization: Expatria Technolgoies; DocumentNumber: 11; Revision: A1; SheetNumber: 11; SheetTotal: 14
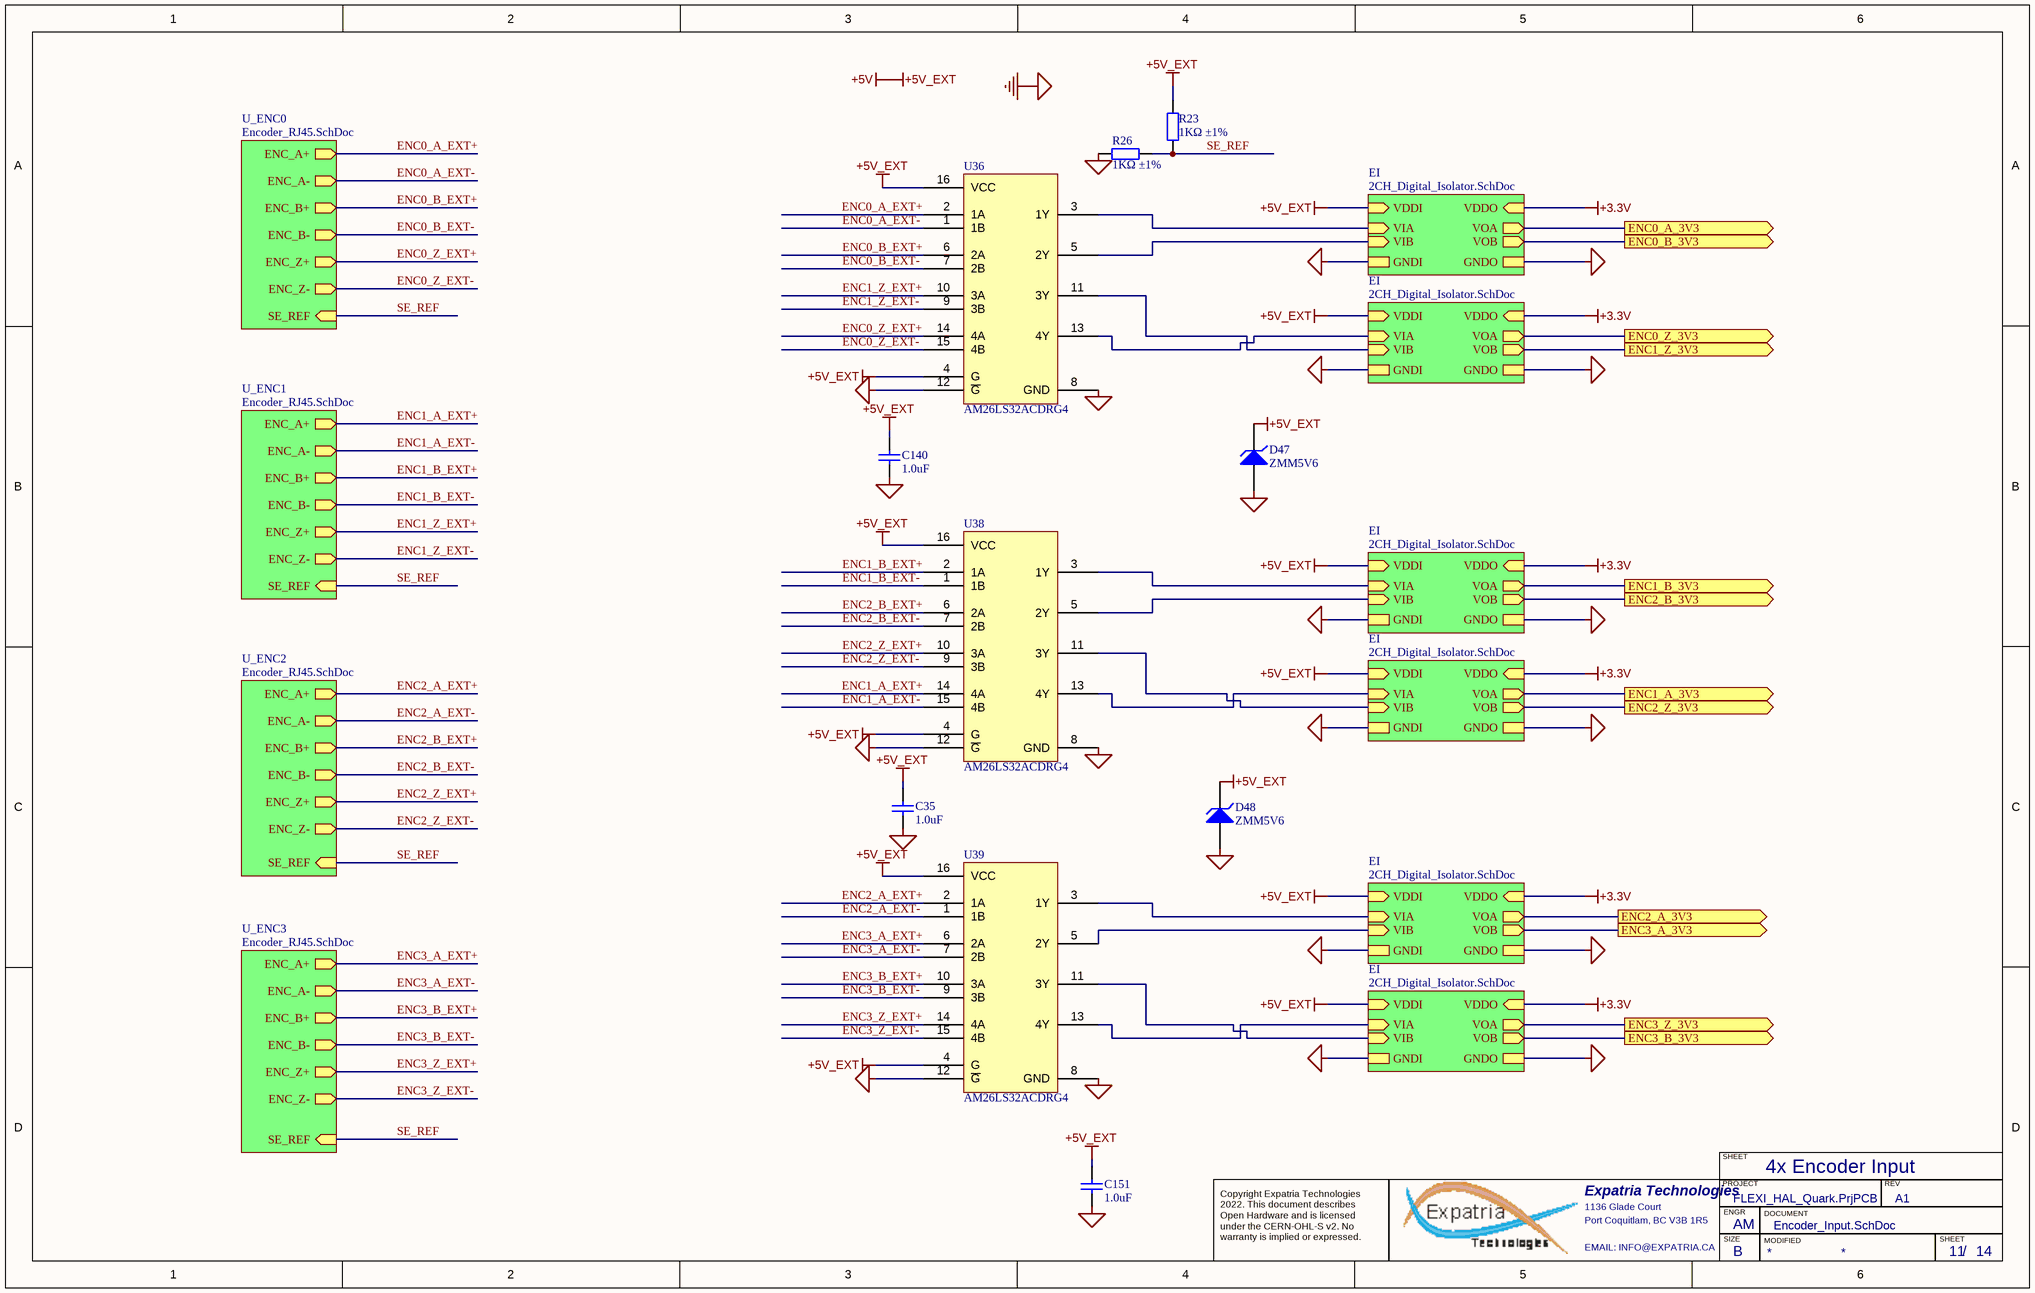
[diagram p14: Encoder_Input.SchDoc]

### Parts
C35  1.0uF  [0402_C]
C140  1.0uF  [0402_C]
C151  1.0uF  [0402_C]
D47  ZMM5V6  [LL-34]
D48  ZMM5V6  [LL-34]
R23  1KΩ ±1%  [0402_R]
R26  1KΩ ±1%  [0402_R]
U36  AM26LS32ACDRG4  [SOIC-16_150mil]
U38  AM26LS32ACDRG4  [SOIC-16_150mil]
U39  AM26LS32ACDRG4  [SOIC-16_150mil]

### Sub-sheets
EI = 2CH_Digital_Isolator.SchDoc: VDDO (in), VIB (in), VIA (in), VOB (out), VOA (out), VDDI (in), GNDO, GNDI
EI = 2CH_Digital_Isolator.SchDoc: VDDO (in), VIB (in), VIA (in), VOB (out), VOA (out), VDDI (in), GNDO, GNDI
EI = 2CH_Digital_Isolator.SchDoc: VDDO (in), VIB (in), VIA (in), VOB (out), VOA (out), VDDI (in), GNDO, GNDI
EI = 2CH_Digital_Isolator.SchDoc: VDDO (in), VIB (in), VIA (in), VOB (out), VOA (out), VDDI (in), GNDO, GNDI
EI = 2CH_Digital_Isolator.SchDoc: VDDO (in), VIB (in), VIA (in), VOB (out), VOA (out), VDDI (in), GNDO, GNDI
EI = 2CH_Digital_Isolator.SchDoc: VDDO (in), VIB (in), VIA (in), VOB (out), VOA (out), VDDI (in), GNDO, GNDI
U_ENC0 = Encoder_RJ45.SchDoc: ENC_A+ (out), ENC_A- (out), ENC_Z+ (out), ENC_Z- (out), ENC_B- (out), ENC_B+ (out), SE_REF (in)
U_ENC1 = Encoder_RJ45.SchDoc: ENC_A+ (out), ENC_A- (out), ENC_Z+ (out), ENC_Z- (out), ENC_B- (out), ENC_B+ (out), SE_REF (in)
U_ENC2 = Encoder_RJ45.SchDoc: ENC_A+ (out), ENC_A- (out), ENC_Z+ (out), ENC_Z- (out), ENC_B- (out), ENC_B+ (out), SE_REF (in)
U_ENC3 = Encoder_RJ45.SchDoc: ENC_A+ (out), ENC_A- (out), ENC_Z+ (out), ENC_Z- (out), ENC_B- (out), ENC_B+ (out), SE_REF (in)

### Ports
ENC0_A_3V3 (out), ENC0_B_3V3 (out), ENC0_Z_3V3 (out), ENC1_A_3V3 (out), ENC1_B_3V3 (out), ENC1_Z_3V3 (out), ENC2_A_3V3 (out), ENC2_B_3V3 (out), ENC2_Z_3V3 (out), ENC3_A_3V3 (out), ENC3_B_3V3 (out), ENC3_Z_3V3 (out)

### Nets
+3.3V: sheet EI/VDDO, sheet EI/VDDO, sheet EI/VDDO, sheet EI/VDDO, sheet EI/VDDO, sheet EI/VDDO
+5V: C35.2 C140.2 C151.2 D47.2(K) D48.2(K) R23.1 U36.4(G) U36.16(VCC) U38.4(G) U38.16(VCC) U39.4(G) U39.16(VCC) ; sheet EI/VDDI, sheet EI/VDDI, sheet EI/VDDI, sheet EI/VDDI, sheet EI/VDDI, sheet EI/VDDI  [also labelled +5V_EXT]
GND: C35.1 C140.1 C151.1 D47.1(A) D48.1(A) R26.1 U36.8(GND) U36.12(~{G}) U38.8(GND) U38.12(~{G}) U39.8(GND) U39.12(~{G}) ; sheet EI/GNDI, sheet EI/GNDI, sheet EI/GNDI, sheet EI/GNDI, sheet EI/GNDI, sheet EI/GNDI  [also labelled GND_EXT]
MCU_GND: sheet EI/GNDO, sheet EI/GNDO, sheet EI/GNDO, sheet EI/GNDO, sheet EI/GNDO, sheet EI/GNDO
ENC0_A_3V3: port ENC0_A_3V3, sheet EI/VOA
ENC0_A_EXT+: U36.2(1A) ; sheet U_ENC0/ENC_A+
ENC0_A_EXT-: U36.1(1B) ; sheet U_ENC0/ENC_A-
ENC0_B_3V3: port ENC0_B_3V3, sheet EI/VOB
ENC0_B_EXT+: U36.6(2A) ; sheet U_ENC0/ENC_B+
ENC0_B_EXT-: U36.7(2B) ; sheet U_ENC0/ENC_B-
ENC0_Z_3V3: port ENC0_Z_3V3, sheet EI/VOA
ENC0_Z_EXT+: U36.14(4A) ; sheet U_ENC0/ENC_Z+
ENC0_Z_EXT-: U36.15(4B) ; sheet U_ENC0/ENC_Z-
ENC1_A_3V3: port ENC1_A_3V3, sheet EI/VOA
ENC1_A_EXT+: U38.14(4A) ; sheet U_ENC1/ENC_A+
ENC1_A_EXT-: U38.15(4B) ; sheet U_ENC1/ENC_A-
ENC1_B_3V3: port ENC1_B_3V3, sheet EI/VOA
ENC1_B_EXT+: U38.2(1A) ; sheet U_ENC1/ENC_B+
ENC1_B_EXT-: U38.1(1B) ; sheet U_ENC1/ENC_B-
ENC1_Z_3V3: port ENC1_Z_3V3, sheet EI/VOB
ENC1_Z_EXT+: U36.10(3A) ; sheet U_ENC1/ENC_Z+
ENC1_Z_EXT-: U36.9(3B) ; sheet U_ENC1/ENC_Z-
ENC2_A_3V3: port ENC2_A_3V3, sheet EI/VOA
ENC2_A_EXT+: U39.2(1A) ; sheet U_ENC2/ENC_A+
ENC2_A_EXT-: U39.1(1B) ; sheet U_ENC2/ENC_A-
ENC2_B_3V3: port ENC2_B_3V3, sheet EI/VOB
ENC2_B_EXT+: U38.6(2A) ; sheet U_ENC2/ENC_B+
ENC2_B_EXT-: U38.7(2B) ; sheet U_ENC2/ENC_B-
ENC2_Z_3V3: port ENC2_Z_3V3, sheet EI/VOB
ENC2_Z_EXT+: U38.10(3A) ; sheet U_ENC2/ENC_Z+
ENC2_Z_EXT-: U38.9(3B) ; sheet U_ENC2/ENC_Z-
ENC3_A_3V3: port ENC3_A_3V3, sheet EI/VOB
ENC3_A_EXT+: U39.6(2A) ; sheet U_ENC3/ENC_A+
ENC3_A_EXT-: U39.7(2B) ; sheet U_ENC3/ENC_A-
ENC3_B_3V3: port ENC3_B_3V3, sheet EI/VOB
ENC3_B_EXT+: U39.10(3A) ; sheet U_ENC3/ENC_B+
ENC3_B_EXT-: U39.9(3B) ; sheet U_ENC3/ENC_B-
ENC3_Z_3V3: port ENC3_Z_3V3, sheet EI/VOA
ENC3_Z_EXT+: U39.14(4A) ; sheet U_ENC3/ENC_Z+
ENC3_Z_EXT-: U39.15(4B) ; sheet U_ENC3/ENC_Z-
SE_REF: R23.2 R26.2 ; sheet U_ENC0/SE_REF, sheet U_ENC1/SE_REF, sheet U_ENC2/SE_REF, sheet U_ENC3/SE_REF
VIA: U36.3(1Y) ; sheet EI/VIA
VIA: U36.13(4Y) ; sheet EI/VIA  [a separate net that carries the same name]
VIA: U38.3(1Y) ; sheet EI/VIA  [a separate net that carries the same name]
VIA: U38.13(4Y) ; sheet EI/VIA  [a separate net that carries the same name]
VIA: U39.3(1Y) ; sheet EI/VIA  [a separate net that carries the same name]
VIA: U39.13(4Y) ; sheet EI/VIA  [a separate net that carries the same name]
VIB: U36.5(2Y) ; sheet EI/VIB
VIB: U36.11(3Y) ; sheet EI/VIB  [a separate net that carries the same name]
VIB: U38.5(2Y) ; sheet EI/VIB  [a separate net that carries the same name]
VIB: U38.11(3Y) ; sheet EI/VIB  [a separate net that carries the same name]
VIB: U39.5(2Y) ; sheet EI/VIB  [a separate net that carries the same name]
VIB: U39.11(3Y) ; sheet EI/VIB  [a separate net that carries the same name]

### Notes on the sheet
- 4x Encoder Input
- SHEET
- Expatria Technologies
- 1136 Glade Court
- Port Coquitlam, BC V3B 1R5
- PROJECT
- SIZE
- ENGR
- MODIFIED
- DOCUMENT
- REV
- Copyright Expatria Technologies 2022. This document describes Open Hardware and is licensed under the CERN-OHL-S v2. No warranty is implied or expressed.
- EMAIL: INFO@EXPATRIA.CA
- B
- /

### Library data of the parts
C35 C140 C151 = 0402 1.0uF (105) 10% 25V: Chip capacitor; Manufacturer: Samsung Electro-Mechanics; PartNumber: CL05A105KA5NQNC; Capacitance: 1uF; Tolerance: 10%; Voltage: 25V; ComponentLink1Description: Supplier link; ComponentLink1URL: http://www.szlcsc.com/product/details_53938.html; Package: 0402; Supplier: LC; SuppliersPartNumber: C52923
D47 D48 = LL-34 ZMM5V6: as D55 on sheet USB_ULPI_Interface; ComponentLink1Description: 供应商链接; ComponentLink1URL: http://www.szlcsc.com/product/details_8541.html; Package: LL-34; Supplier: LC; SuppliersPartNumber: C8062
R23 R26 = 0402 1K (1001) 1%: Chip resistor; Manufacturer: Uniroyal Elec; PartNumber: 0402WGF1001TCE; Power: 1/16W; ComponentLink1Description: Supplier link; ComponentLink1URL: http://www.szlcsc.com/product/details_12256.html; Package: 0402; Supplier: LC; SuppliersPartNumber: C11702; Resistance: 1KΩ; Tolerance: 1%
U36 U38 U39 = AM26LS32ACDRG4_[C6180]: RS-422 Interface IC Quad Diff Line Rcvr; ComponentLink1Description: 供应商链接; ComponentLink1URL: http://www.szlcsc.com/product/details_6646.html; Package: SOIC-16_150mil; Supplier: LC; SuppliersPartNumber: C6180

## Sheet Encoder_RJ45.SchDoc: STM32F446 CNC
size B; Author: AM; CompanyName: Expatria Technologies; DrawnBy: A.Marles; Engineer: AM; Organization: Expatria Technolgoies; DocumentNumber: 11; Revision: A1; SheetNumber: 11; SheetTotal: 14
Used 4 times, as channels STM32F446 CNC Controller/4 Encoder Inputs/U_ENC0, STM32F446 CNC Controller/4 Encoder Inputs/U_ENC1, STM32F446 CNC Controller/4 Encoder Inputs/U_ENC2, STM32F446 CNC Controller/4 Encoder Inputs/U_ENC3. Parts and nets are listed once, with the designators drawn on the sheet.
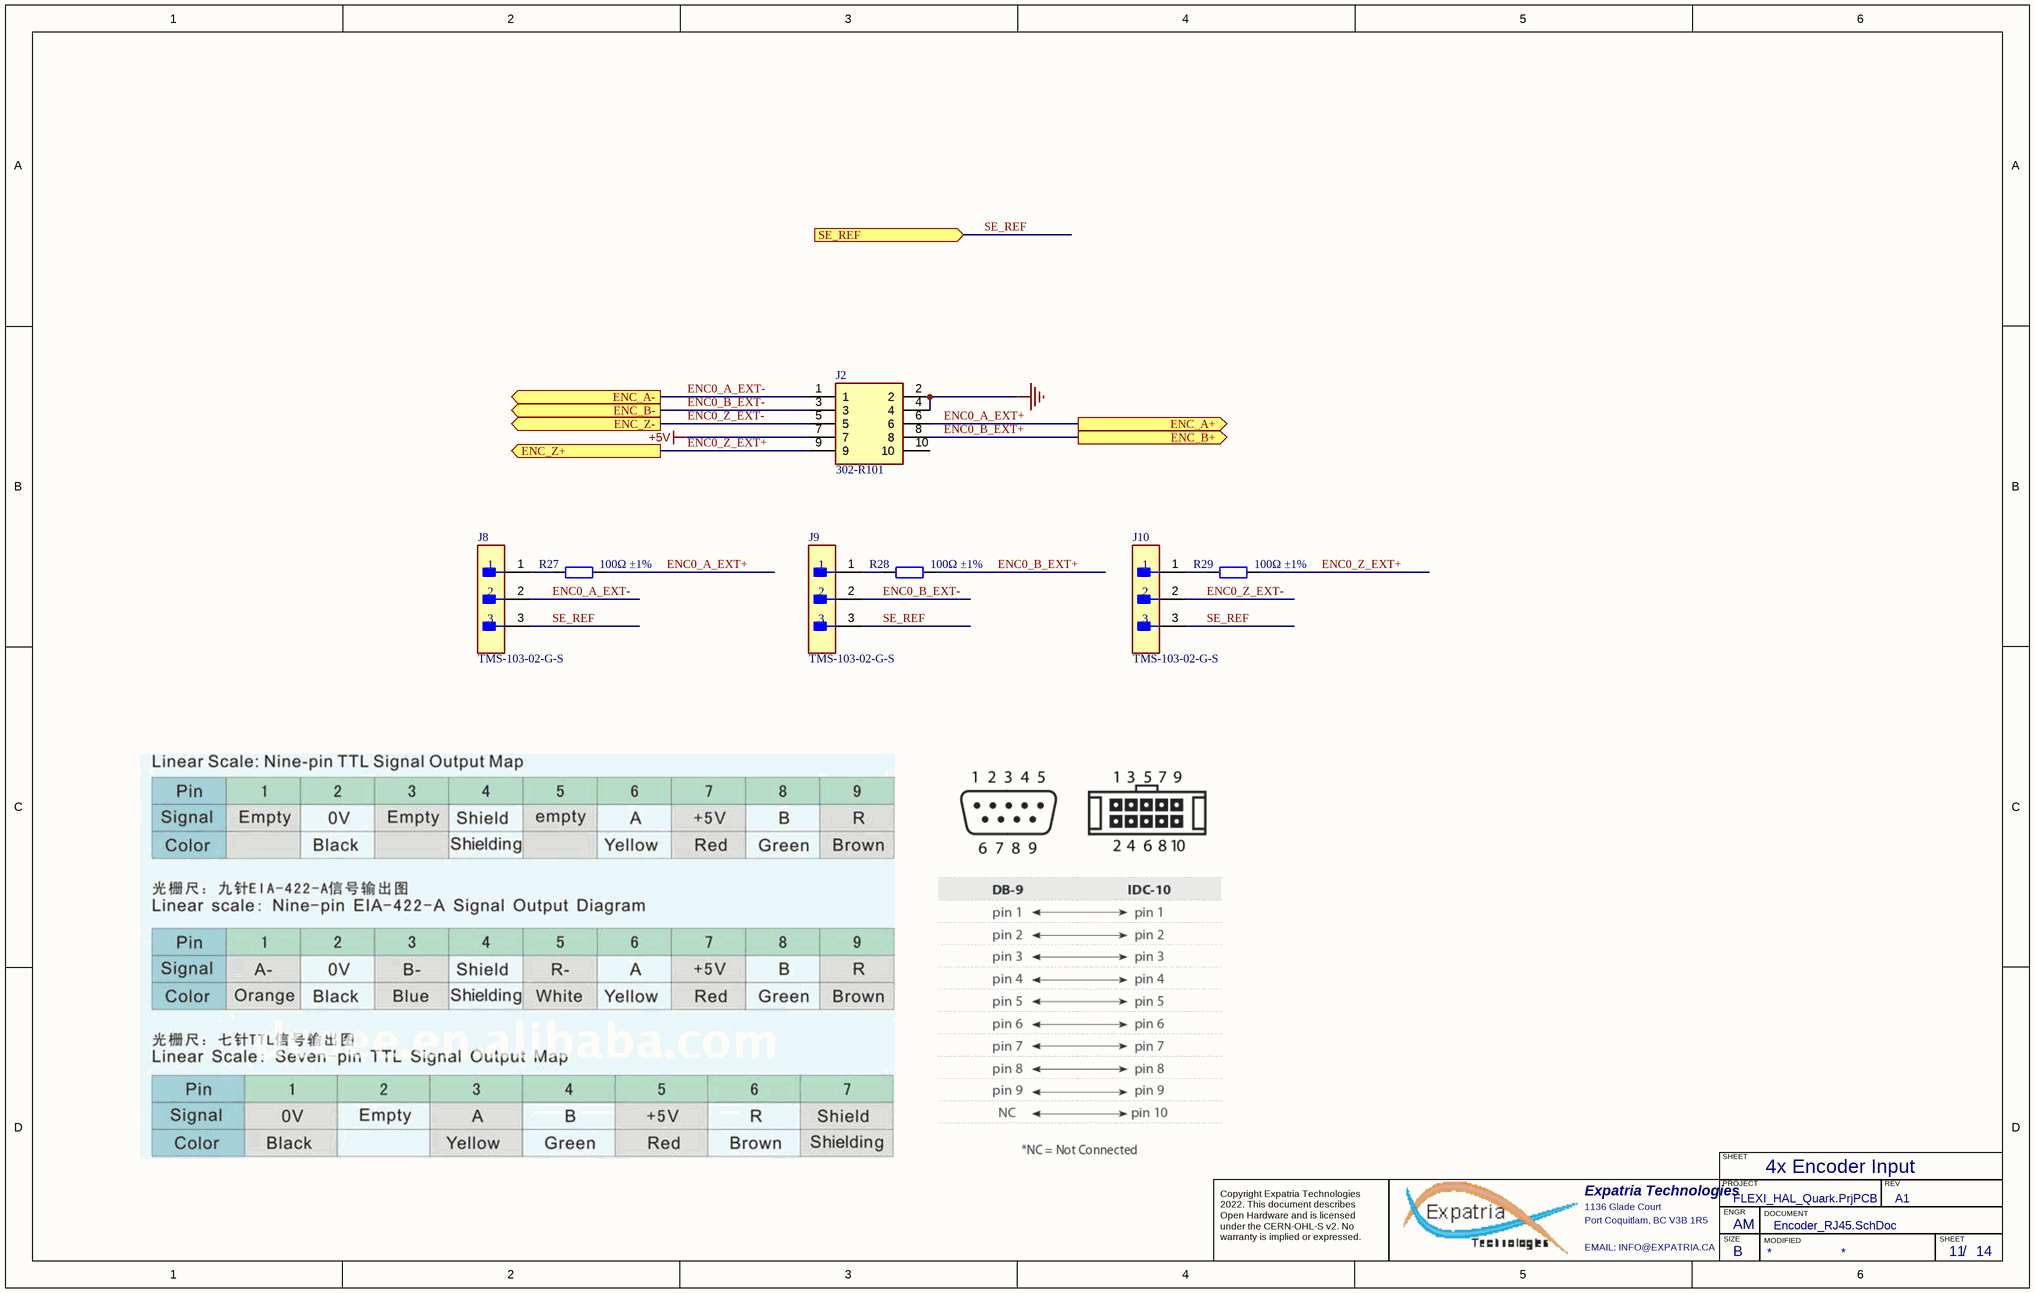
[diagram p15: Encoder_RJ45.SchDoc]

### Parts
J2  302-R101  [SHDRRA10W66P254_2X5_2032X910X910P]
J8  TMS-103-02-G-S  [FP-TMS-103-02-G-S-MFG]
J9  TMS-103-02-G-S  [FP-TMS-103-02-G-S-MFG]
J10  TMS-103-02-G-S  [FP-TMS-103-02-G-S-MFG]
R27  100Ω ±1%  [0402_R]
R28  100Ω ±1%  [0402_R]
R29  100Ω ±1%  [0402_R]

### Ports
ENC_A+ (out), ENC_A- (out), ENC_B+ (out), ENC_B- (out), ENC_Z+ (out), ENC_Z- (out), SE_REF (in)

### Nets
+5V: J2.7
GND: J2.2 J2.4
ENC0_A_EXT+: J2.6 R27.2 ; port ENC_A+
ENC0_A_EXT-: J2.1 J8.2 ; port ENC_A-
ENC0_B_EXT+: J2.8 R28.2 ; port ENC_B+
ENC0_B_EXT-: J2.3 J9.2 ; port ENC_B-
ENC0_Z_EXT+: J2.9 R29.2 ; port ENC_Z+
ENC0_Z_EXT-: J2.5 J10.2 ; port ENC_Z-
SE_REF: J8.3 J9.3 J10.3 ; port SE_REF
NetJ8_1: J8.1 R27.1
NetJ9_1: J9.1 R28.1
NetJ10_1: J10.1 R29.1

Not connected (* = marked no-connect by the designer): J2 10

### Channels
STM32F446 CNC Controller/4 Encoder Inputs/U_ENC0: designators end in _U_ENC0; ports ENC_A+=ENC0_A_EXT+ ENC_A-=ENC0_A_EXT- ENC_B+=ENC0_B_EXT+ ENC_B-=ENC0_B_EXT- ENC_Z+=ENC0_Z_EXT+ ENC_Z-=ENC0_Z_EXT- SE_REF=SE_REF
STM32F446 CNC Controller/4 Encoder Inputs/U_ENC1: designators end in _U_ENC1; ports ENC_A+=ENC1_A_EXT+ ENC_A-=ENC1_A_EXT- ENC_B+=ENC1_B_EXT+ ENC_B-=ENC1_B_EXT- ENC_Z+=ENC1_Z_EXT+ ENC_Z-=ENC1_Z_EXT- SE_REF=SE_REF
STM32F446 CNC Controller/4 Encoder Inputs/U_ENC2: designators end in _U_ENC2; ports ENC_A+=ENC2_A_EXT+ ENC_A-=ENC2_A_EXT- ENC_B+=ENC2_B_EXT+ ENC_B-=ENC2_B_EXT- ENC_Z+=ENC2_Z_EXT+ ENC_Z-=ENC2_Z_EXT- SE_REF=SE_REF
STM32F446 CNC Controller/4 Encoder Inputs/U_ENC3: designators end in _U_ENC3; ports ENC_A+=ENC3_A_EXT+ ENC_A-=ENC3_A_EXT- ENC_B+=ENC3_B_EXT+ ENC_B-=ENC3_B_EXT- ENC_Z+=ENC3_Z_EXT+ ENC_Z-=ENC3_Z_EXT- SE_REF=SE_REF

### Notes on the sheet
- 4x Encoder Input
- SHEET
- Expatria Technologies
- 1136 Glade Court
- Port Coquitlam, BC V3B 1R5
- PROJECT
- SIZE
- ENGR
- MODIFIED
- DOCUMENT
- REV
- Copyright Expatria Technologies 2022. This document describes Open Hardware and is licensed under the CERN-OHL-S v2. No warranty is implied or expressed.
- EMAIL: INFO@EXPATRIA.CA
- B
- /

### Library data of the parts
J2 = 302-R101: Connector; Manufacturer_Name: On Shore Technology Inc.; Datasheet Link: http://www.on-shore.com/wp-content/uploads/2015/09/302-rxxx.pdf; Height: 9.1mm; Manufacturer_Part_Number: 302-R101; Arrow Part Number: 302-R101; Arrow Price/Stock: https://www.arrow.com/en/products/302-r101/on-shore-technology?region=nac
J8-J10 = CMP-02766-001782-1: CONN HEADER VERT 3POS 1.27MM; Number of Positions: 3; Max Current Rating: 1A; Gender: Male; Min Operating Temperature: -55°C; Housing Material: Polymer; Reach SVHC Compliant: Yes; Length: 3.81mm; Contact Material: Bronze; Series: TMS; Packaging: Bulk; Radiation Hardening: No; Insulation Material: Polymer; Contact Type: Male Pin; Orientation: Straight; Housing Color: Black; Contact Finish - Mating: GOLD; Contact Plating: Gold; Flammability Rating: UL94 V-0; Contact Shape: Square; Depth: 2.48mm; Pitch: 1.27mm; Fastening Type: Pull; RoHS Compliant: Yes; Termination: Solder; Number of Rows: 1; Insulation Color: Black; Number of Contacts: 3; Connector Type: Header; Max Operating Temperature: 125°C
R27-R29 = 0402 100R (1000) 1%: Chip resistor; Manufacturer: Uniroyal Elec; PartNumber: 0402WGF1000TCE; Power: 1/16W; ComponentLink1Description: Supplier link; ComponentLink1URL: http://www.szlcsc.com/product/details_25819.html; Package: 0402; Supplier: LC; SuppliersPartNumber: C25076; Resistance: 100Ω; Tolerance: 1%

## Sheet Serial_Expansion.SchDoc: RP2040 CNC
size B; Author: AM; CompanyName: Expatria Technologies; DrawnBy: A.Marles; Engineer: AM; Organization: Expatria Technolgoies; DocumentNumber: 7; Revision: A1; SheetNumber: 7; SheetTotal: 14
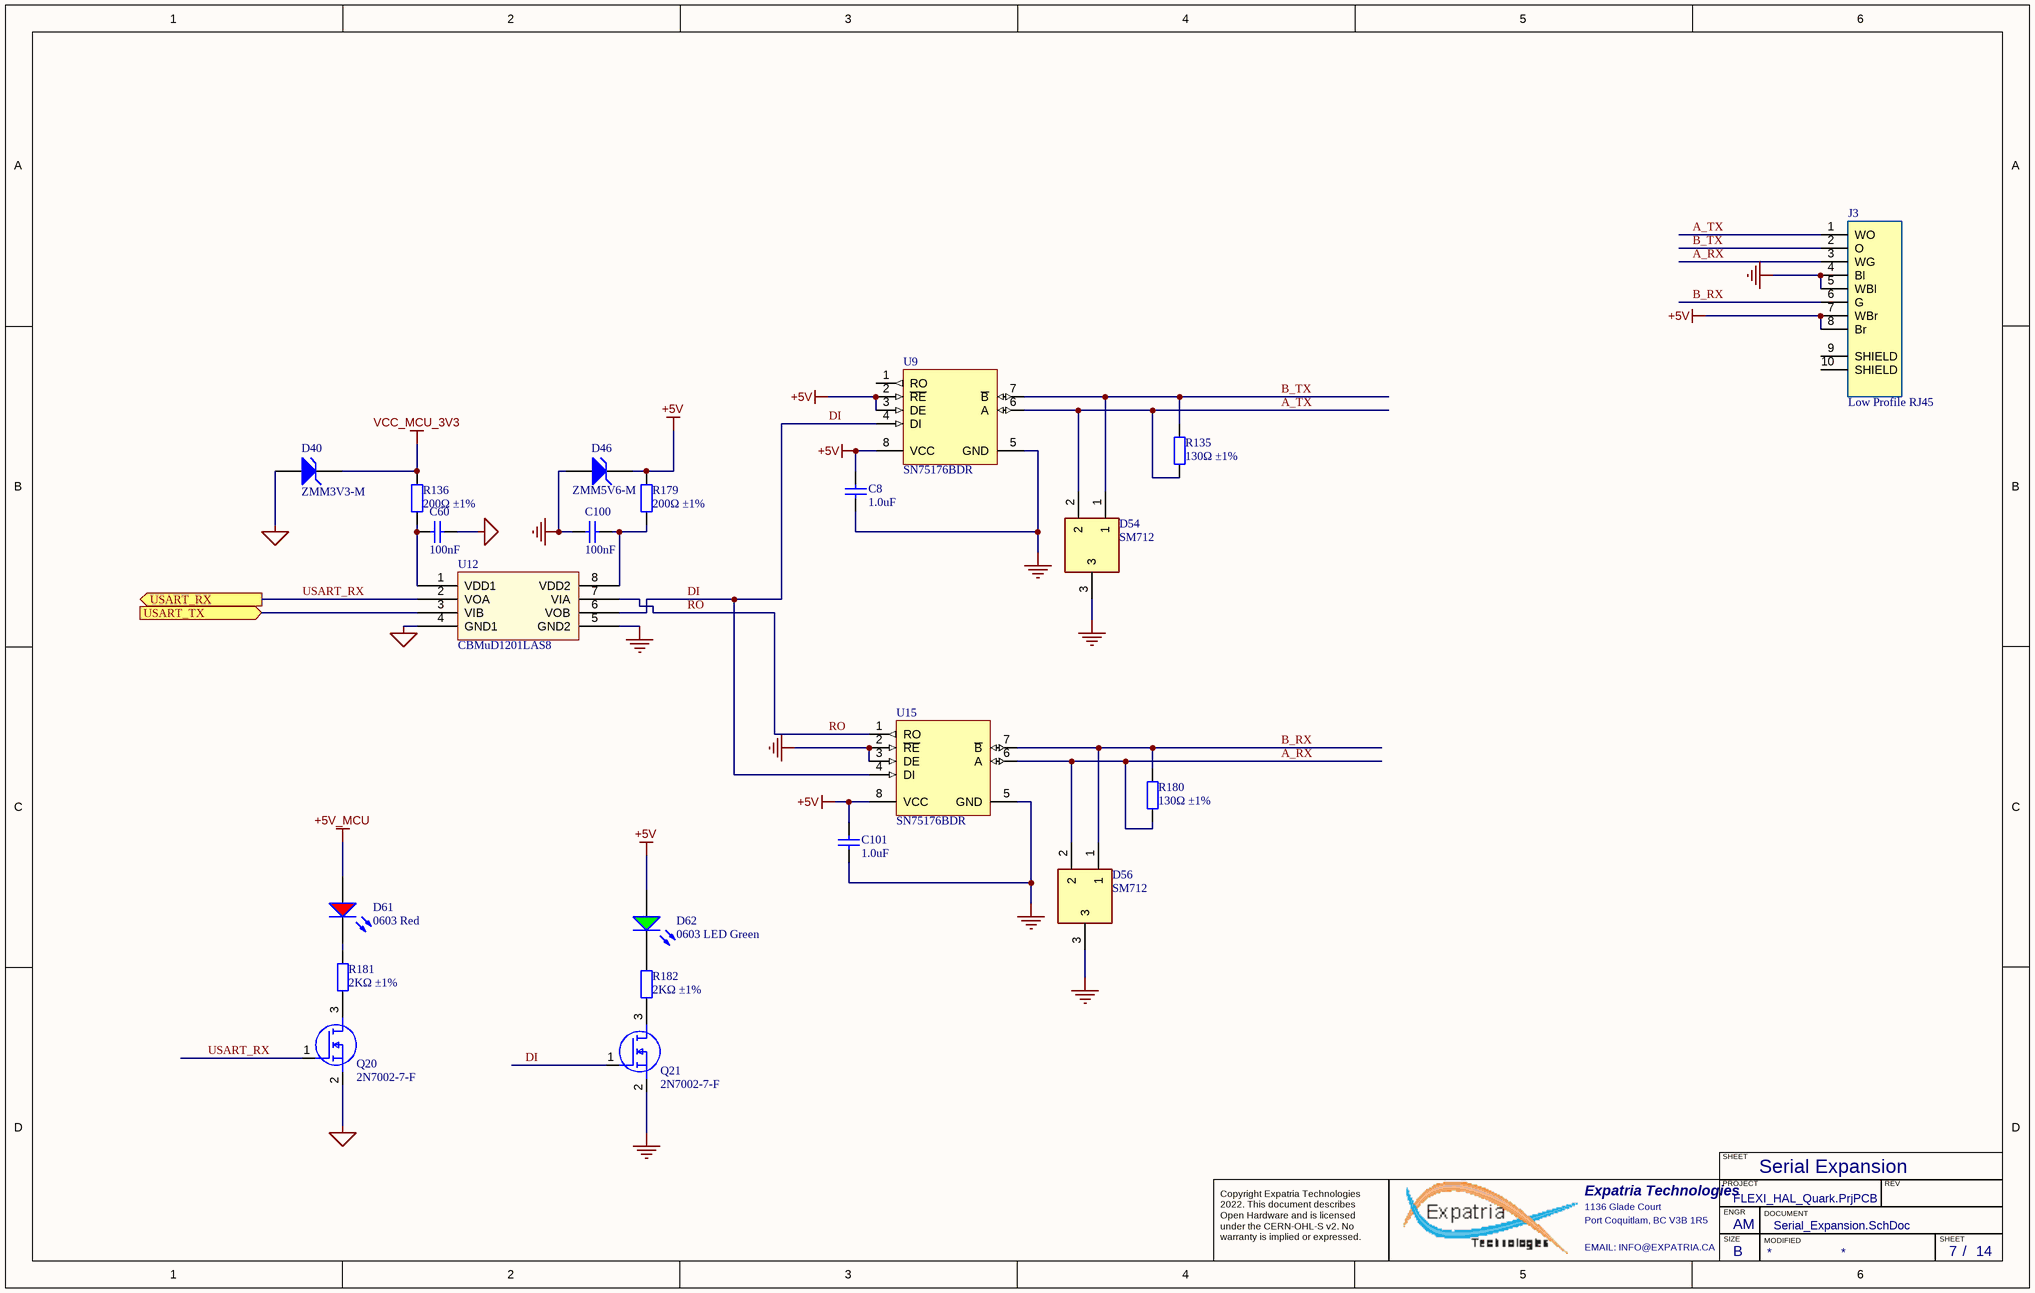
[diagram p16: Serial_Expansion.SchDoc]

### Parts
C8  1.0uF  [0402_C]
C60  100nF  [0402_C]
C100  100nF  [0402_C]
C101  1.0uF  [0402_C]
D40  ZMM3V3-M  [LL-34]
D46  ZMM5V6-M  [LL-34]
D54  SM712  [SOT95P230X117-3N]
D56  SM712  [SOT95P230X117-3N]
D61  0603 Red  [0603_LED_S1]
D62  0603 LED Green  [0603_LED_S1]
J3  Low Profile RJ45  [RJ45-SMD_MJ88-B011-HLSV6-P]
Q20  2N7002-7-F  [SOT-23(SOT-23-3)]
Q21  2N7002-7-F  [SOT-23(SOT-23-3)]
R135  130Ω ±1%  [0603_R]
R136  200Ω ±1%  [0402_R]
R179  200Ω ±1%  [0402_R]
R180  130Ω ±1%  [0603_R]
R181  2KΩ ±1%  [0402_R]
R182  2KΩ ±1%  [0402_R]
U9  SN75176BDR  [SOIC-8_150mil]
U12  CBMuD1201LAS8  [SOIC-8_150mil]
U15  SN75176BDR  [SOIC-8_150mil]

### Ports
USART_RX (out), USART_TX (in)

### Nets
+5V: C8.2 C101.2 D46.2(K) D62.A J3.7(WBr) J3.8(Br) R179.2 U9.2(~{RE}) U9.3(DE) U9.8(VCC) U15.8(VCC)
+5V_MCU: D61.A
GND: C8.1 C100.1 C101.1 D46.1(A) D54.3 D56.3 J3.4(Bl) J3.5(WBl) Q21.2(S) U9.5(GND) U12.5(GND2) U15.2(~{RE}) U15.3(DE) U15.5(GND)
MCU_GND: C60.2 D40.1(A) Q20.2(S) U12.4(GND1)
VCC_MCU_3V3: D40.2(K) R136.2  [project net +3.3V]
A_RX: D56.2 J3.3(WG) R180.1 U15.6(A)
A_TX: D54.2 J3.1(WO) R135.1 U9.6(A)
B_RX: D56.1 J3.6(G) R180.2 U15.7(~{B})
B_TX: D54.1 J3.2(O) R135.2 U9.7(~{B})
DI: Q21.1(G) U9.4(DI) U12.6(VOB) U15.4(DI)
RO: U12.7(VIA) U15.1(RO)
USART_RX: Q20.1(G) U12.2(VOA) ; port USART_RX
USART_TX: U12.3(VIB) ; port USART_TX
NetC60_1: C60.1 R136.1 U12.1(VDD1)
NetC100_2: C100.2 R179.1 U12.8(VDD2)
NetD61_K: D61.K R181.2
NetD62_K: D62.K R182.2
NetQ20_3: Q20.3(D) R181.1
NetQ21_3: Q21.3(D) R182.1

Not connected (* = marked no-connect by the designer): J3 9(SHIELD) 10(SHIELD); U9 1(RO)

### Notes on the sheet
- Serial Expansion
- SHEET
- Expatria Technologies
- 1136 Glade Court
- Port Coquitlam, BC V3B 1R5
- PROJECT
- SIZE
- ENGR
- MODIFIED
- DOCUMENT
- REV
- Copyright Expatria Technologies 2022. This document describes Open Hardware and is licensed under the CERN-OHL-S v2. No warranty is implied or expressed.
- EMAIL: INFO@EXPATRIA.CA
- B
- /

### Library data of the parts
C8 C101 = 0402 1.0uF (105) 10% 25V: as C35 on sheet Encoder_Input; ComponentLink1Description: Supplier link; ComponentLink1URL: http://www.szlcsc.com/product/details_53938.html; Package: 0402; Supplier: LC; SuppliersPartNumber: C52923
C60 C100 = 0402 100nF (104) 10% 16V: 16V 100nF X7R ±10% 0402 Multilayer Ceramic Capacitors MLCC - SMD/SMT ROHS; Manufacturer: Samsung Electro-Mechanics; Manufacturer Part Number: CL05B104KO5NNNC; ComponentLink1Description: Supplier link; ComponentLink1URL: http://www.szlcsc.com/product/details_1877.html; Package: 0402; Supplier: LC; SuppliersPartNumber: C1525; Capacitance: 100nF; Tolerance: 10%; Voltage: 16V
D40 = LL-34 ZMM3V3-M: Single 3.1V~3.5V 500mW 3.3V LL-34 Zener Diodes ROHS; Manufacturer: ST(Semtech); ComponentLink1Description: 供应商链接; ComponentLink1URL: http://www.szlcsc.com/product/details_8541.html; Package: LL-34; Supplier: LC; SuppliersPartNumber: C8056; Manufacturer Part Number: ZMM3V3-M
D46 = LL-34 ZMM5V6-M: Single 5.2V~6V 500mW 5.6V LL-34 Zener Diodes ROHS; Manufacturer: ST(Semtech); ComponentLink1Description: 供应商链接; ComponentLink1URL: http://www.szlcsc.com/product/details_8541.html; Package: LL-34; Supplier: LC; SuppliersPartNumber: C8062; Manufacturer Part Number: ZMM5V6-M
D54 D56 = CDSOT23-SM712: Bidirectional 12V (Max), 7V (Max) 7.5V / 13.3V 10V / 20V 12A(8/20us) SOT-23-3 TVS RoHS; Manufacturer_Name: DOWO; Height: 1.17mm; Manufacturer_Part_Number: SM712; SuppliersPartNumber: C293966
D61 = 19-213SURC/S530-A3/TR8: as D57 on sheet CANBUS_Pendant; ComponentLink1Description: 供应商链接; ComponentLink1URL: http://www.szlcsc.com/product/details_2659.html; Package: 0603; Supplier: LC; SuppliersPartNumber: C72039; Color: Red; Supplier 1: LC; Supplier Part Number 1: C72039; Manufacturer Part Number: 19-213SURC/S530-A3/TR8
D62 = 19-217/GHC-YR1S2/3T: as D58 on sheet CANBUS_Pendant; Package: 0603; Supplier: LC; SuppliersPartNumber: C72043; Color: Green; Manufacturer Part Number: 19-217/GHC-YR1S2/3T
J3 = MJ88-B011-HLSV6-P: Micro USB; MF: Heling; SuppliersPartNumber: C501463; Part+Number: MJ88-B011-HLSV6-P
Q20 Q21 = 2N7002-7-F: as Q15 on sheet CANBUS_Pendant; SuppliersPartNumber: C85049; Manufacturer Part Number: 2N7002-7-F; Value: 2N7002-7-F; Datasheet Link: https://datasheet.datasheetarchive.com/originals/distributors/SFDatasheet-0/sf-0003625.pdf; Height: 1.2mm; Manufacturer_Part_Number: 2N7002-7-F; Mouser Part Number: 621-2N7002-F; Mouser Price/Stock: https://www.mouser.co.uk/ProductDetail/Diodes-Incorporated/2N7002-7-F?qs=jMXWnm70%252BC%252BAX%252BMLzUkTZg%3D%3D; Arrow Part Number: 2N7002-7-F; Arrow Price/Stock: https://www.arrow.com/en/products/2n7002-7-f/diodes-incorporated?region=nac
R135 R180 = 0603 130R (1300) 1%: Chip resistor; Manufacturer: Uniroyal Elec; PartNumber: 0603WAF1300T5E; Power: 1/10W; ComponentLink1Description: Supplier link; ComponentLink1URL: http://www.szlcsc.com/product/details_23523.html; Package: 0603; Supplier: LC; SuppliersPartNumber: C22796; Resistance: 130Ω; Tolerance: 1%
R136 R179 = 0402 200R (2000) 1%: Chip resistor; Manufacturer: Uniroyal Elec; Manufacturer Part Number: 0402WGF2000TCE; Power: 1/16W; ComponentLink1Description: Supplier link; ComponentLink1URL: http://www.szlcsc.com/product/details_25830.html; Package: 0402; Supplier: LC; SuppliersPartNumber: C25087; Resistance: 200Ω; Tolerance: 1%
R181 R182 = 0402 2K (2001) 1%: as R61 on sheet CANBUS_Pendant; ComponentLink1Description: Supplier link; ComponentLink1URL: http://www.szlcsc.com/product/details_4516.html; Package: 0402; Supplier: LC; SuppliersPartNumber: C4109; Resistance: 2KΩ; Tolerance: 1%
U9 U15 = SN75176BDR_[C7063]: RS-485/RS-422; ComponentLink1Description: 供应商链接; ComponentLink1URL: http://www.szlcsc.com/product/details_7535.html; Package: SOIC-8_150mil; Supplier: LC; SuppliersPartNumber: C7063
U12 = CBMuD1201LAS8: Dual Channel Isolator; Manufacturer: Corebai Microelectronics; Package: SOIC-8_150mil; Supplier: LC; SuppliersPartNumber: C476472; ComponentLink1Description: 供应商链接; ComponentLink1URL: http://www.szlcsc.com/product/details_10199.html; Manufacturer Part Number: CBMuD1201LAS8

## Sheet Mezz_connector.SchDoc: RP2040 CNC
size B; Author: AM; CompanyName: Expatria Technologies; DrawnBy: A.Marles; Engineer: AM; Organization: Expatria Technolgoies; DocumentNumber: 7; Revision: A1; SheetNumber: 7; SheetTotal: 14
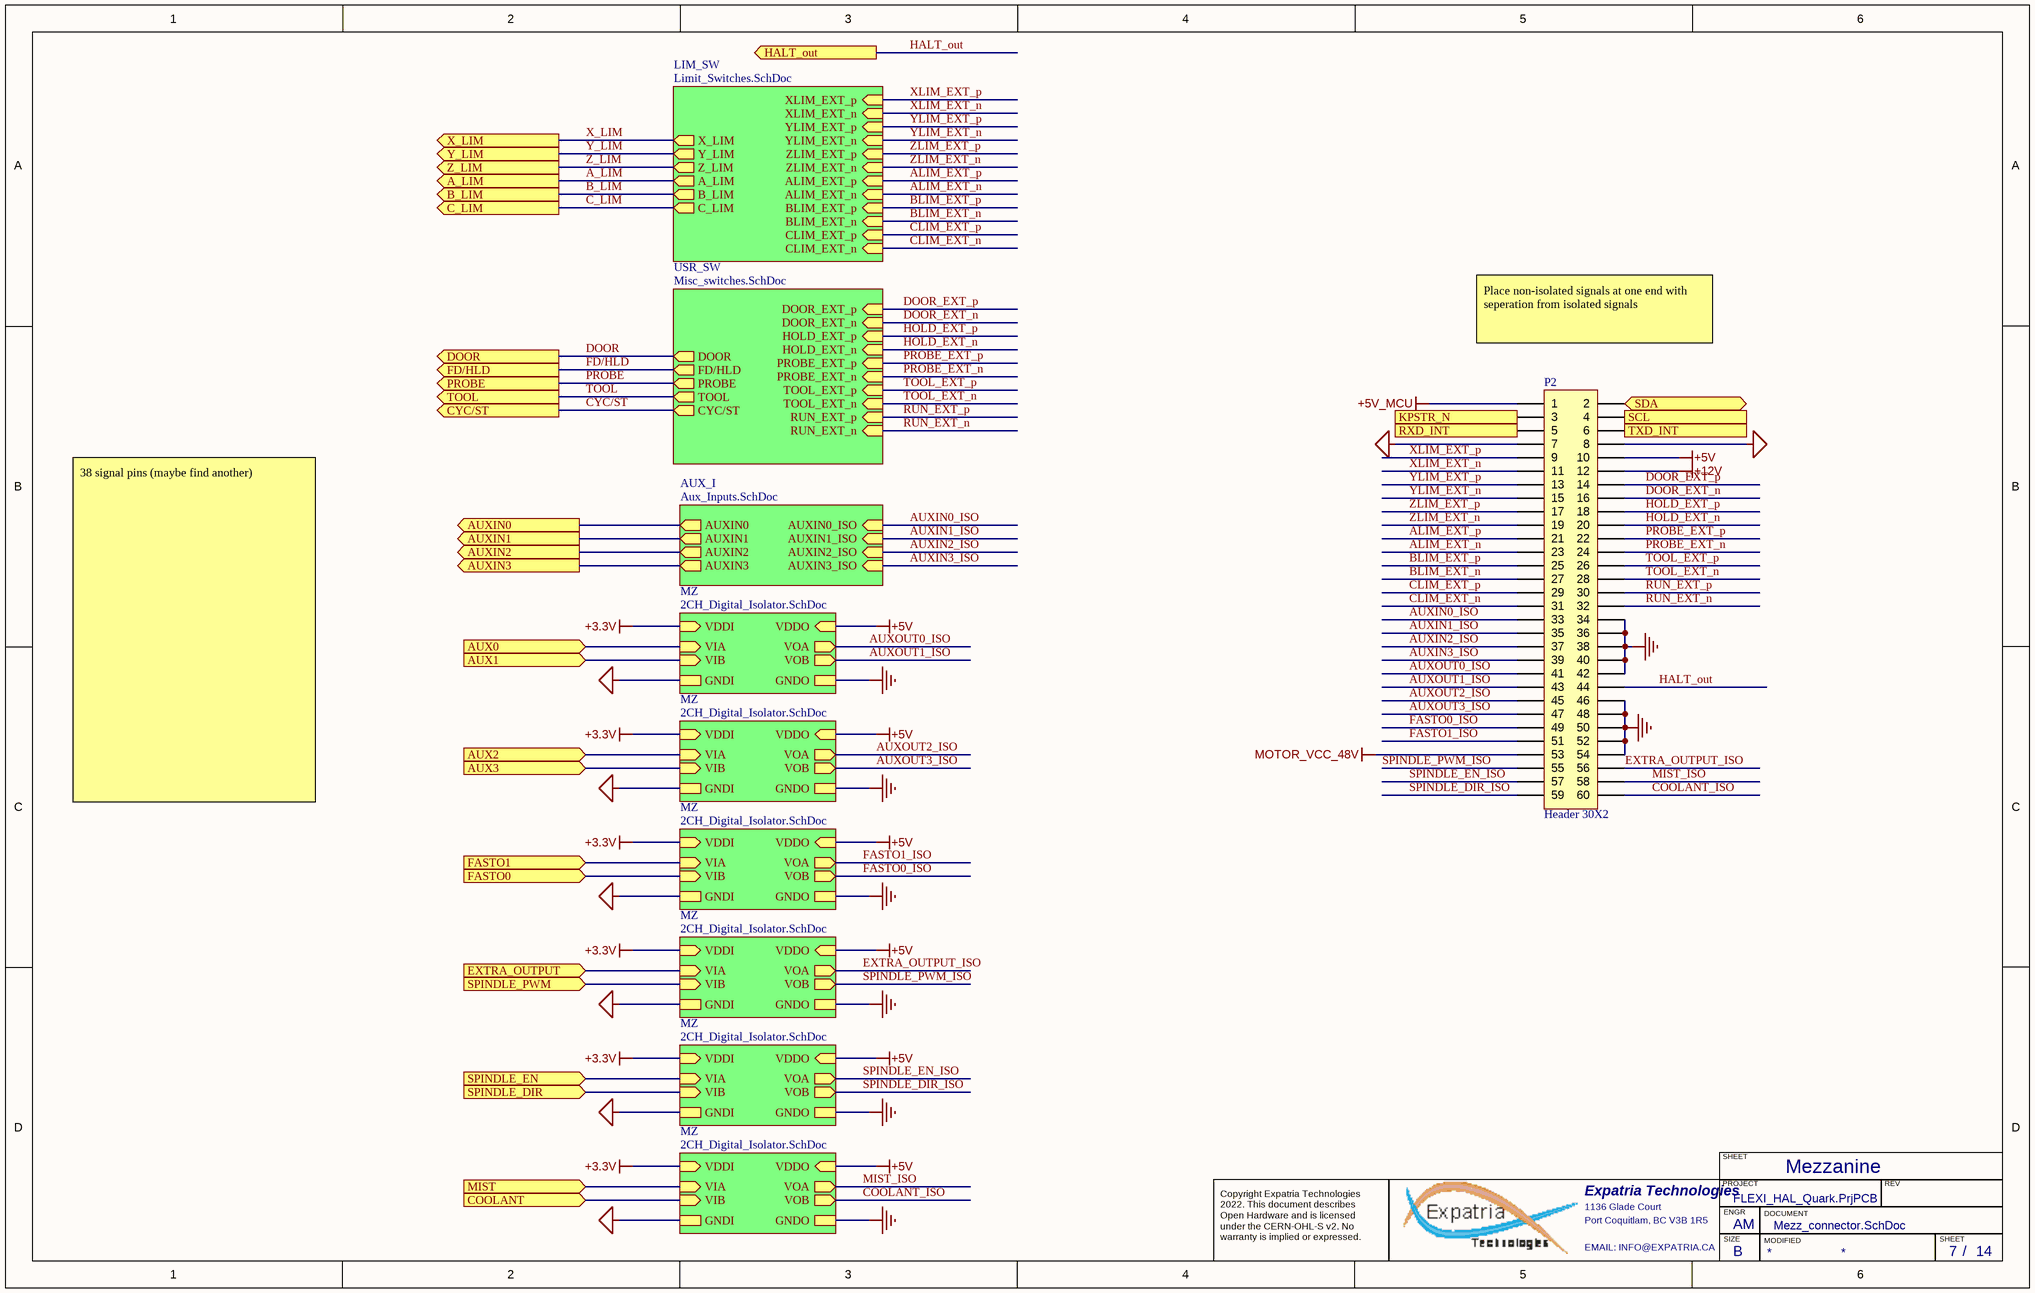
[diagram p17: Mezz_connector.SchDoc]

### Parts
P2  Header 30X2  [Flexi-Quark-Mezzanine]

### Sub-sheets
AUX_I = Aux_Inputs.SchDoc: AUXIN3 (out), AUXIN0 (out), AUXIN1 (out), AUXIN2 (out), AUXIN0_ISO (in), AUXIN3_ISO (in), AUXIN1_ISO (in), AUXIN2_ISO (in)
LIM_SW = Limit_Switches.SchDoc: Y_LIM (out), Z_LIM (out), X_LIM (out), A_LIM (out), B_LIM (out), C_LIM (out), CLIM_EXT_n (in), BLIM_EXT_n (in), ALIM_EXT_n (in), BLIM_EXT_p (in), CLIM_EXT_p (in), ALIM_EXT_p (in), ZLIM_EXT_p (in), XLIM_EXT_n (in), XLIM_EXT_p (in), ZLIM_EXT_n (in), YLIM_EXT_n (in), YLIM_EXT_p (in)
MZ = 2CH_Digital_Isolator.SchDoc: VDDO (in), VIB (in), VIA (in), VOB (out), VOA (out), VDDI (in), GNDO, GNDI
MZ = 2CH_Digital_Isolator.SchDoc: VDDO (in), VIB (in), VIA (in), VOB (out), VOA (out), VDDI (in), GNDO, GNDI
MZ = 2CH_Digital_Isolator.SchDoc: VDDO (in), VIB (in), VIA (in), VOB (out), VOA (out), VDDI (in), GNDO, GNDI
MZ = 2CH_Digital_Isolator.SchDoc: VDDO (in), VIB (in), VIA (in), VOB (out), VOA (out), VDDI (in), GNDO, GNDI
MZ = 2CH_Digital_Isolator.SchDoc: VDDO (in), VIB (in), VIA (in), VOB (out), VOA (out), VDDI (in), GNDO, GNDI
MZ = 2CH_Digital_Isolator.SchDoc: VDDO (in), VIB (in), VIA (in), VOB (out), VOA (out), VDDI (in), GNDO, GNDI
USR_SW = Misc_switches.SchDoc: FD/HLD (out), PROBE (out), CYC/ST (out), DOOR (out), TOOL (out), PROBE_EXT_n (in), RUN_EXT_p (in), PROBE_EXT_p (in), DOOR_EXT_n (in), TOOL_EXT_n (in), TOOL_EXT_p (in), HOLD_EXT_n (in), RUN_EXT_n (in), HOLD_EXT_p (in), DOOR_EXT_p (in)

### Ports
A_LIM (out), AUX0 (in), AUX1 (in), AUX2 (in), AUX3 (in), AUXIN0 (out), AUXIN1 (out), AUXIN2 (out), AUXIN3 (out), B_LIM (out), C_LIM (out), COOLANT (in), CYC/ST (out), DOOR (out), EXTRA_OUTPUT (in), FASTO0 (in), FASTO1 (in), FD/HLD (out), HALT_out (out), KPSTR_N (out), MIST (in), PROBE (out), RXD_INT (out), SCL (in), SDA (bidir), SPINDLE_DIR (in), SPINDLE_EN (in), SPINDLE_PWM (in), TOOL (out), TXD_INT (in), X_LIM (out), Y_LIM (out), Z_LIM (out)

### Nets
+3.3V: sheet MZ/VDDI, sheet MZ/VDDI, sheet MZ/VDDI, sheet MZ/VDDI, sheet MZ/VDDI, sheet MZ/VDDI
+5V: P2.10 ; sheet MZ/VDDO, sheet MZ/VDDO, sheet MZ/VDDO, sheet MZ/VDDO, sheet MZ/VDDO, sheet MZ/VDDO
+5V_MCU: P2.1
+12V: P2.12
GND: P2.34 P2.36 P2.38 P2.40 P2.42 P2.46 P2.48 P2.50 P2.52 P2.54 ; sheet MZ/GNDO, sheet MZ/GNDO, sheet MZ/GNDO, sheet MZ/GNDO, sheet MZ/GNDO, sheet MZ/GNDO
MCU_GND: P2.7 P2.8 ; sheet MZ/GNDI, sheet MZ/GNDI, sheet MZ/GNDI, sheet MZ/GNDI, sheet MZ/GNDI, sheet MZ/GNDI
MOTOR_VCC_48V: P2.53
A_LIM: port A_LIM, sheet LIM_SW/A_LIM
ALIM_EXT_n: P2.23 ; sheet LIM_SW/ALIM_EXT_n
ALIM_EXT_p: P2.21 ; sheet LIM_SW/ALIM_EXT_p
AUXIN0_ISO: P2.33 ; sheet AUX_I/AUXIN0_ISO
AUXIN1_ISO: P2.35 ; sheet AUX_I/AUXIN1_ISO
AUXIN2_ISO: P2.37 ; sheet AUX_I/AUXIN2_ISO
AUXIN3_ISO: P2.39 ; sheet AUX_I/AUXIN3_ISO
AUXIN_0: port AUXIN0, sheet AUX_I/AUXIN0
AUXIN_1: port AUXIN1, sheet AUX_I/AUXIN1
AUXIN_2: port AUXIN2, sheet AUX_I/AUXIN2
AUXIN_3: port AUXIN3, sheet AUX_I/AUXIN3
AUXOUT0_ISO: P2.41 ; sheet MZ/VOA
AUXOUT1_ISO: P2.43 ; sheet MZ/VOB
AUXOUT2_ISO: P2.45 ; sheet MZ/VOA
AUXOUT3_ISO: P2.47 ; sheet MZ/VOB
AUXOUT_0: port AUX0, sheet MZ/VIA
AUXOUT_1: port AUX1, sheet MZ/VIB
AUXOUT_2: port AUX2, sheet MZ/VIA
AUXOUT_3: port AUX3, sheet MZ/VIB
B_LIM: port B_LIM, sheet LIM_SW/B_LIM
BLIM_EXT_n: P2.27 ; sheet LIM_SW/BLIM_EXT_n
BLIM_EXT_p: P2.25 ; sheet LIM_SW/BLIM_EXT_p
C_LIM: port C_LIM, sheet LIM_SW/C_LIM
CLIM_EXT_n: P2.31 ; sheet LIM_SW/CLIM_EXT_n
CLIM_EXT_p: P2.29 ; sheet LIM_SW/CLIM_EXT_p
COOLANT: port COOLANT, sheet MZ/VIB
COOLANT_ISO: P2.60 ; sheet MZ/VOB
CYC/ST: port CYC/ST, sheet USR_SW/CYC/ST
DOOR: port DOOR, sheet USR_SW/DOOR
DOOR_EXT_n: P2.16 ; sheet USR_SW/DOOR_EXT_n
DOOR_EXT_p: P2.14 ; sheet USR_SW/DOOR_EXT_p
EXTRA_OUTPUT: port EXTRA_OUTPUT, sheet MZ/VIA
EXTRA_OUTPUT_ISO: P2.56 ; sheet MZ/VOA
FASTO0: port FASTO0, sheet MZ/VIB
FASTO0_ISO: P2.49 ; sheet MZ/VOB
FASTO1: port FASTO1, sheet MZ/VIA
FASTO1_ISO: P2.51 ; sheet MZ/VOA
FD/HLD: port FD/HLD, sheet USR_SW/FD/HLD
HALT_out: P2.44 ; port HALT_out
HOLD_EXT_n: P2.20 ; sheet USR_SW/HOLD_EXT_n
HOLD_EXT_p: P2.18 ; sheet USR_SW/HOLD_EXT_p
KPSTR: P2.3 ; port KPSTR_N
MIST: port MIST, sheet MZ/VIA
MIST_ISO: P2.58 ; sheet MZ/VOA
PROBE: port PROBE, sheet USR_SW/PROBE
PROBE_EXT_n: P2.24 ; sheet USR_SW/PROBE_EXT_n
PROBE_EXT_p: P2.22 ; sheet USR_SW/PROBE_EXT_p
RUN_EXT_n: P2.32 ; sheet USR_SW/RUN_EXT_n
RUN_EXT_p: P2.30 ; sheet USR_SW/RUN_EXT_p
RXD_INT: P2.5 ; port RXD_INT
SCL: P2.4 ; port SCL
SDA: P2.2 ; port SDA
SPINDLE_DIR: port SPINDLE_DIR, sheet MZ/VIB
SPINDLE_DIR_ISO: P2.59 ; sheet MZ/VOB
SPINDLE_EN: port SPINDLE_EN, sheet MZ/VIA
SPINDLE_EN_ISO: P2.57 ; sheet MZ/VOA
SPINDLE_PWM: port SPINDLE_PWM, sheet MZ/VIB
SPINDLE_PWM_ISO: P2.55 ; sheet MZ/VOB
TOOL: port TOOL, sheet USR_SW/TOOL
TOOL_EXT_n: P2.28 ; sheet USR_SW/TOOL_EXT_n
TOOL_EXT_p: P2.26 ; sheet USR_SW/TOOL_EXT_p
TXD_INT: P2.6 ; port TXD_INT
X_LIM: port X_LIM, sheet LIM_SW/X_LIM
XLIM_EXT_n: P2.11 ; sheet LIM_SW/XLIM_EXT_n
XLIM_EXT_p: P2.9 ; sheet LIM_SW/XLIM_EXT_p
Y_LIM: port Y_LIM, sheet LIM_SW/Y_LIM
YLIM_EXT_n: P2.15 ; sheet LIM_SW/YLIM_EXT_n
YLIM_EXT_p: P2.13 ; sheet LIM_SW/YLIM_EXT_p
Z_LIM: port Z_LIM, sheet LIM_SW/Z_LIM
ZLIM_EXT_n: P2.19 ; sheet LIM_SW/ZLIM_EXT_n
ZLIM_EXT_p: P2.17 ; sheet LIM_SW/ZLIM_EXT_p

### Notes on the sheet
- Place non-isolated signals at one end with seperation from isolated signals
- 38 signal pins (maybe find another)
- Mezzanine
- SHEET
- Expatria Technologies
- 1136 Glade Court
- Port Coquitlam, BC V3B 1R5
- PROJECT
- SIZE
- ENGR
- MODIFIED
- DOCUMENT
- REV
- Copyright Expatria Technologies 2022. This document describes Open Hardware and is licensed under the CERN-OHL-S v2. No warranty is implied or expressed.
- EMAIL: INFO@EXPATRIA.CA
- B
- /

### Library data of the parts
P2 = Header 30X2: Header, 30-Pin, Dual row; LatestRevisionDate: 17-Jul-2002; LatestRevisionNote: Re-released for DXP Platform.; Publisher: Altium Limited